# EAGLE design esquemático_CPLD (EAGLE 9.6.2)

## Sheet 1 of 4
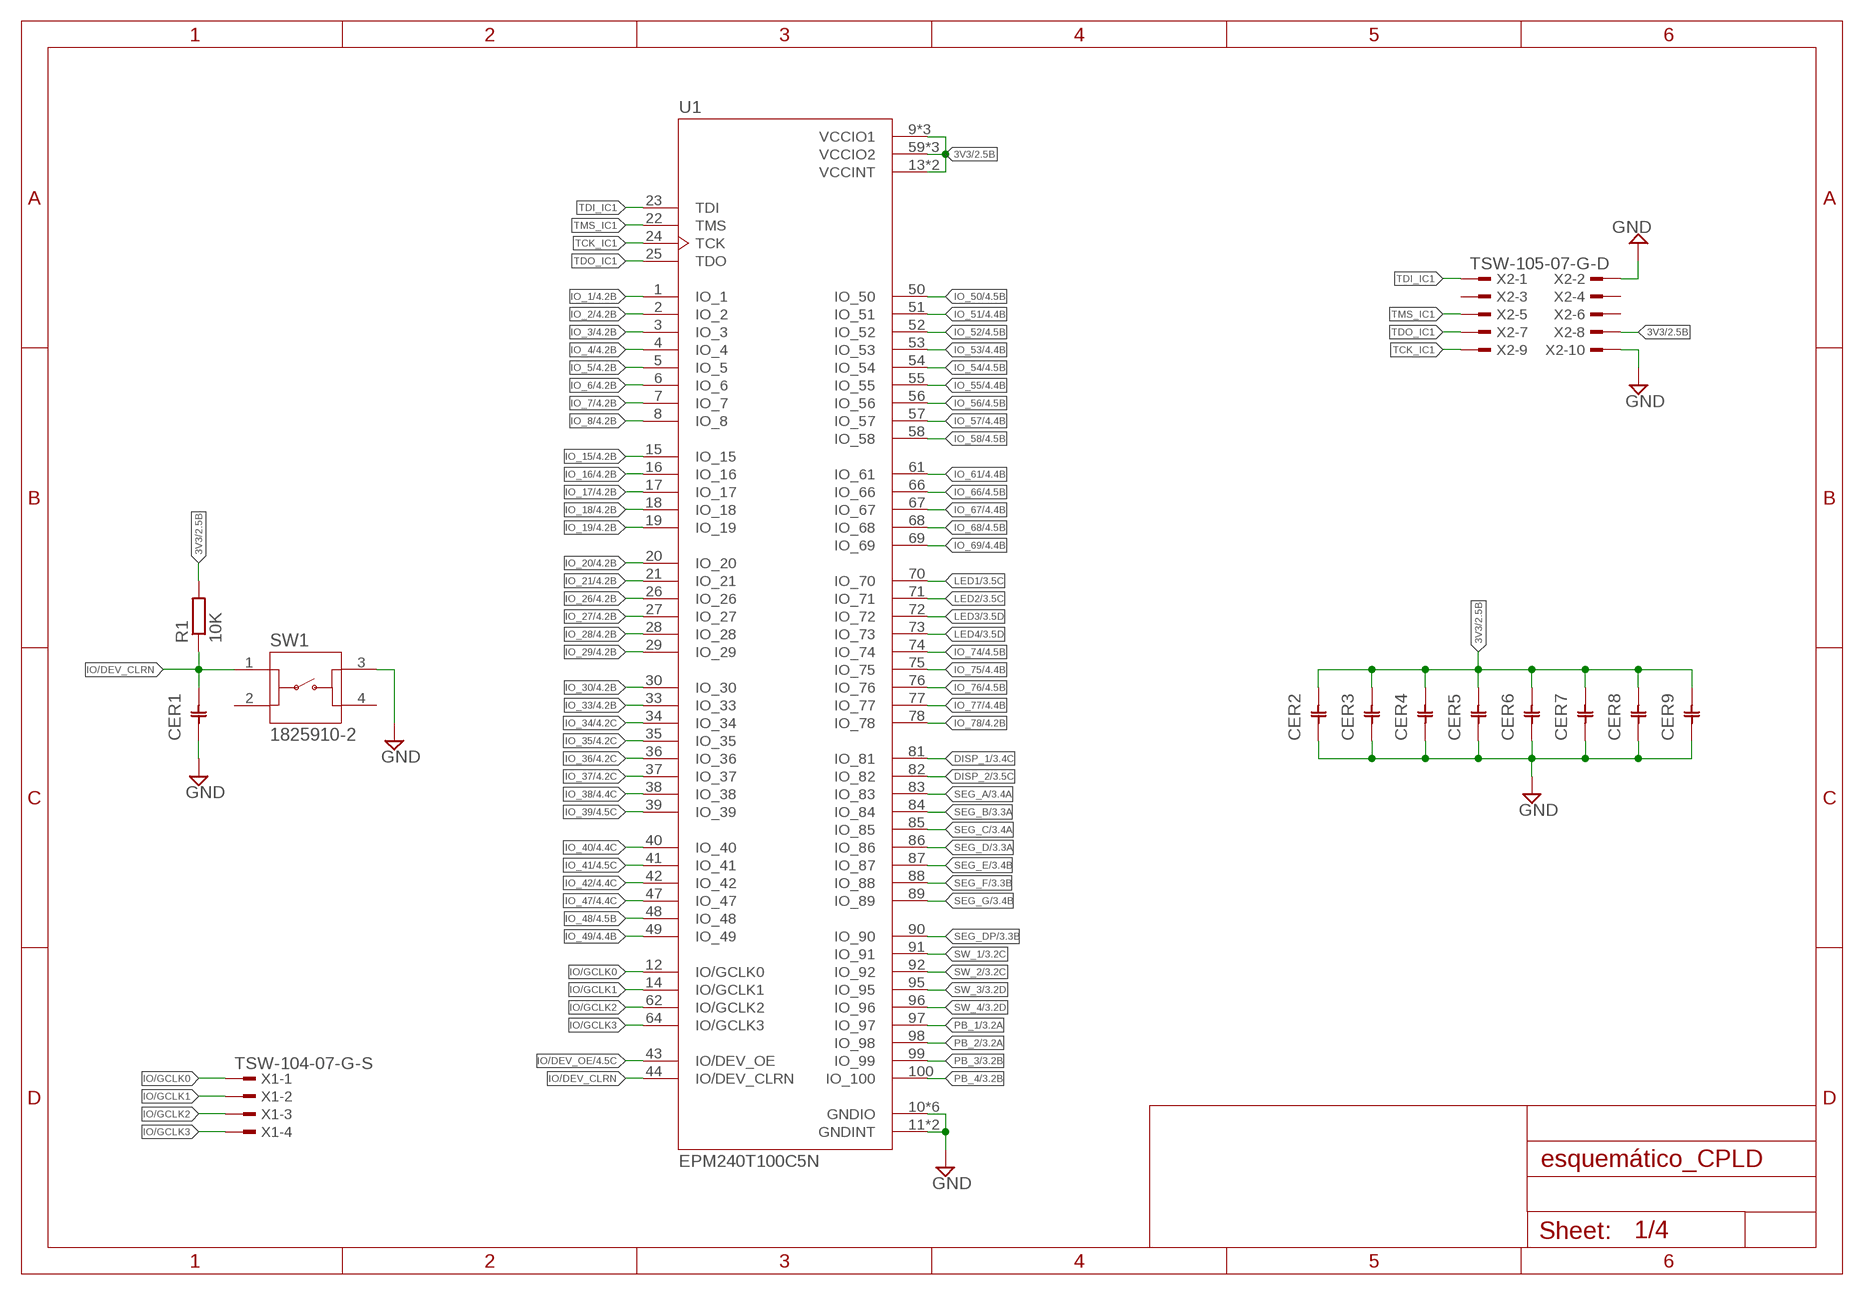
[diagram p0: schematic, sheet 1]

### Parts
CER1  100nF  -CERACAP  [CERACAPA]
CER2  100nF  -CERACAP  [CERACAPA]
CER3  100nF  -CERACAP  [CERACAPA]
CER4  100nF  -CERACAP  [CERACAPA]
CER5  100nF  -CERACAP  [CERACAPA]
CER6  100nF  -CERACAP  [CERACAPA]
CER7  100nF  -CERACAP  [CERACAPA]
CER8  100nF  -CERACAP  [CERACAPA]
CER9  100nF  -CERACAP  [CERACAPA]
R1  10K  R-EU_0204/7  [0204/7]
SW1  1825910-2  [TE_1825910-2]
U1  EPM240T100C5N  [QFP50P1600X1600X120-100N]
X1  TSW-104-07-G-S  [TSW-104-XX-G-S]
X2  TSW-105-07-G-D  [TSW-105-XX-G-D]

### Nets
3V3: CER2.P$2 CER3.P$2 CER4.P$2 CER5.P$2 CER6.P$2 CER7.P$2 CER8.P$2 CER9.P$2 R1.2 U1.9(VCCIO1) U1.13(VCCINT) U1.31(VCCIO1) U1.45(VCCIO1) U1.59(VCCIO2) U1.63(VCCINT) U1.80(VCCIO2) U1.94(VCCIO2) X2.8 ; also sheet 2,3,4
DISP_1: U1.81(IO_81) ; also sheet 3
DISP_2: U1.82(IO_82) ; also sheet 3
GND: CER1.P$1 CER2.P$1 CER3.P$1 CER4.P$1 CER5.P$1 CER6.P$1 CER7.P$1 CER8.P$1 CER9.P$1 SW1.3 U1.10(GNDIO) U1.11(GNDINT) U1.32(GNDIO) U1.46(GNDIO) U1.60(GNDIO) U1.65(GNDINT) U1.79(GNDIO) U1.93(GNDIO) X2.2 X2.10 ; also sheet 2,3,4
IO/DEV_CLRN: CER1.P$2 R1.1 SW1.1 U1.44(IO/DEV_CLRN)
IO/DEV_OE: U1.43(IO/DEV_OE) ; also sheet 4
IO/GCLK0: U1.12(IO/GCLK0) X1.1
IO/GCLK1: U1.14(IO/GCLK1) X1.2
IO/GCLK2: U1.62(IO/GCLK2) X1.3
IO/GCLK3: U1.64(IO/GCLK3) X1.4
IO_1: U1.1(IO_1) ; also sheet 4
IO_2: U1.2(IO_2) ; also sheet 4
IO_3: U1.3(IO_3) ; also sheet 4
IO_4: U1.4(IO_4) ; also sheet 4
IO_5: U1.5(IO_5) ; also sheet 4
IO_6: U1.6(IO_6) ; also sheet 4
IO_7: U1.7(IO_7) ; also sheet 4
IO_8: U1.8(IO_8) ; also sheet 4
IO_15: U1.15(IO_15) ; also sheet 4
IO_16: U1.16(IO_16) ; also sheet 4
IO_17: U1.17(IO_17) ; also sheet 4
IO_18: U1.18(IO_18) ; also sheet 4
IO_19: U1.19(IO_19) ; also sheet 4
IO_20: U1.20(IO_20) ; also sheet 4
IO_21: U1.21(IO_21) ; also sheet 4
IO_26: U1.26(IO_26) ; also sheet 4
IO_27: U1.27(IO_27) ; also sheet 4
IO_28: U1.28(IO_28) ; also sheet 4
IO_29: U1.29(IO_29) ; also sheet 4
IO_30: U1.30(IO_30) ; also sheet 4
IO_33: U1.33(IO_33) ; also sheet 4
IO_34: U1.34(IO_34) ; also sheet 4
IO_35: U1.35(IO_35) ; also sheet 4
IO_36: U1.36(IO_36) ; also sheet 4
IO_37: U1.37(IO_37) ; also sheet 4
IO_38: U1.38(IO_38) ; also sheet 4
IO_39: U1.39(IO_39) ; also sheet 4
IO_40: U1.40(IO_40) ; also sheet 4
IO_41: U1.41(IO_41) ; also sheet 4
IO_42: U1.42(IO_42) ; also sheet 4
IO_47: U1.47(IO_47) ; also sheet 4
IO_48: U1.48(IO_48) ; also sheet 4
IO_49: U1.49(IO_49) ; also sheet 4
IO_50: U1.50(IO_50) ; also sheet 4
IO_51: U1.51(IO_51) ; also sheet 4
IO_52: U1.52(IO_52) ; also sheet 4
IO_53: U1.53(IO_53) ; also sheet 4
IO_54: U1.54(IO_54) ; also sheet 4
IO_55: U1.55(IO_55) ; also sheet 4
IO_56: U1.56(IO_56) ; also sheet 4
IO_57: U1.57(IO_57) ; also sheet 4
IO_58: U1.58(IO_58) ; also sheet 4
IO_61: U1.61(IO_61) ; also sheet 4
IO_66: U1.66(IO_66) ; also sheet 4
IO_67: U1.67(IO_67) ; also sheet 4
IO_68: U1.68(IO_68) ; also sheet 4
IO_69: U1.69(IO_69) ; also sheet 4
IO_74: U1.74(IO_74) ; also sheet 4
IO_75: U1.75(IO_75) ; also sheet 4
IO_76: U1.76(IO_76) ; also sheet 4
IO_77: U1.77(IO_77) ; also sheet 4
IO_78: U1.78(IO_78) ; also sheet 4
LED1: U1.70(IO_70) ; also sheet 3
LED2: U1.71(IO_71) ; also sheet 3
LED3: U1.72(IO_72) ; also sheet 3
LED4: U1.73(IO_73) ; also sheet 3
PB_1: U1.97(IO_97) ; also sheet 3
PB_2: U1.98(IO_98) ; also sheet 3
PB_3: U1.99(IO_99) ; also sheet 3
PB_4: U1.100(IO_100) ; also sheet 3
SEG_A: U1.83(IO_83) ; also sheet 3
SEG_B: U1.84(IO_84) ; also sheet 3
SEG_C: U1.85(IO_85) ; also sheet 3
SEG_D: U1.86(IO_86) ; also sheet 3
SEG_DP: U1.90(IO_90) ; also sheet 3
SEG_E: U1.87(IO_87) ; also sheet 3
SEG_F: U1.88(IO_88) ; also sheet 3
SEG_G: U1.89(IO_89) ; also sheet 3
SW_1: U1.91(IO_91) ; also sheet 3
SW_2: U1.92(IO_92) ; also sheet 3
SW_3: U1.95(IO_95) ; also sheet 3
SW_4: U1.96(IO_96) ; also sheet 3
TCK_IC1: U1.24(TCK) X2.9
TDI_IC1: U1.23(TDI) X2.1
TDO_IC1: U1.25(TDO) X2.7
TMS_IC1: U1.22(TMS) X2.5
Unconnected: SW1.2 SW1.4 X2.3 X2.4 X2.6

## Sheet 2 of 4
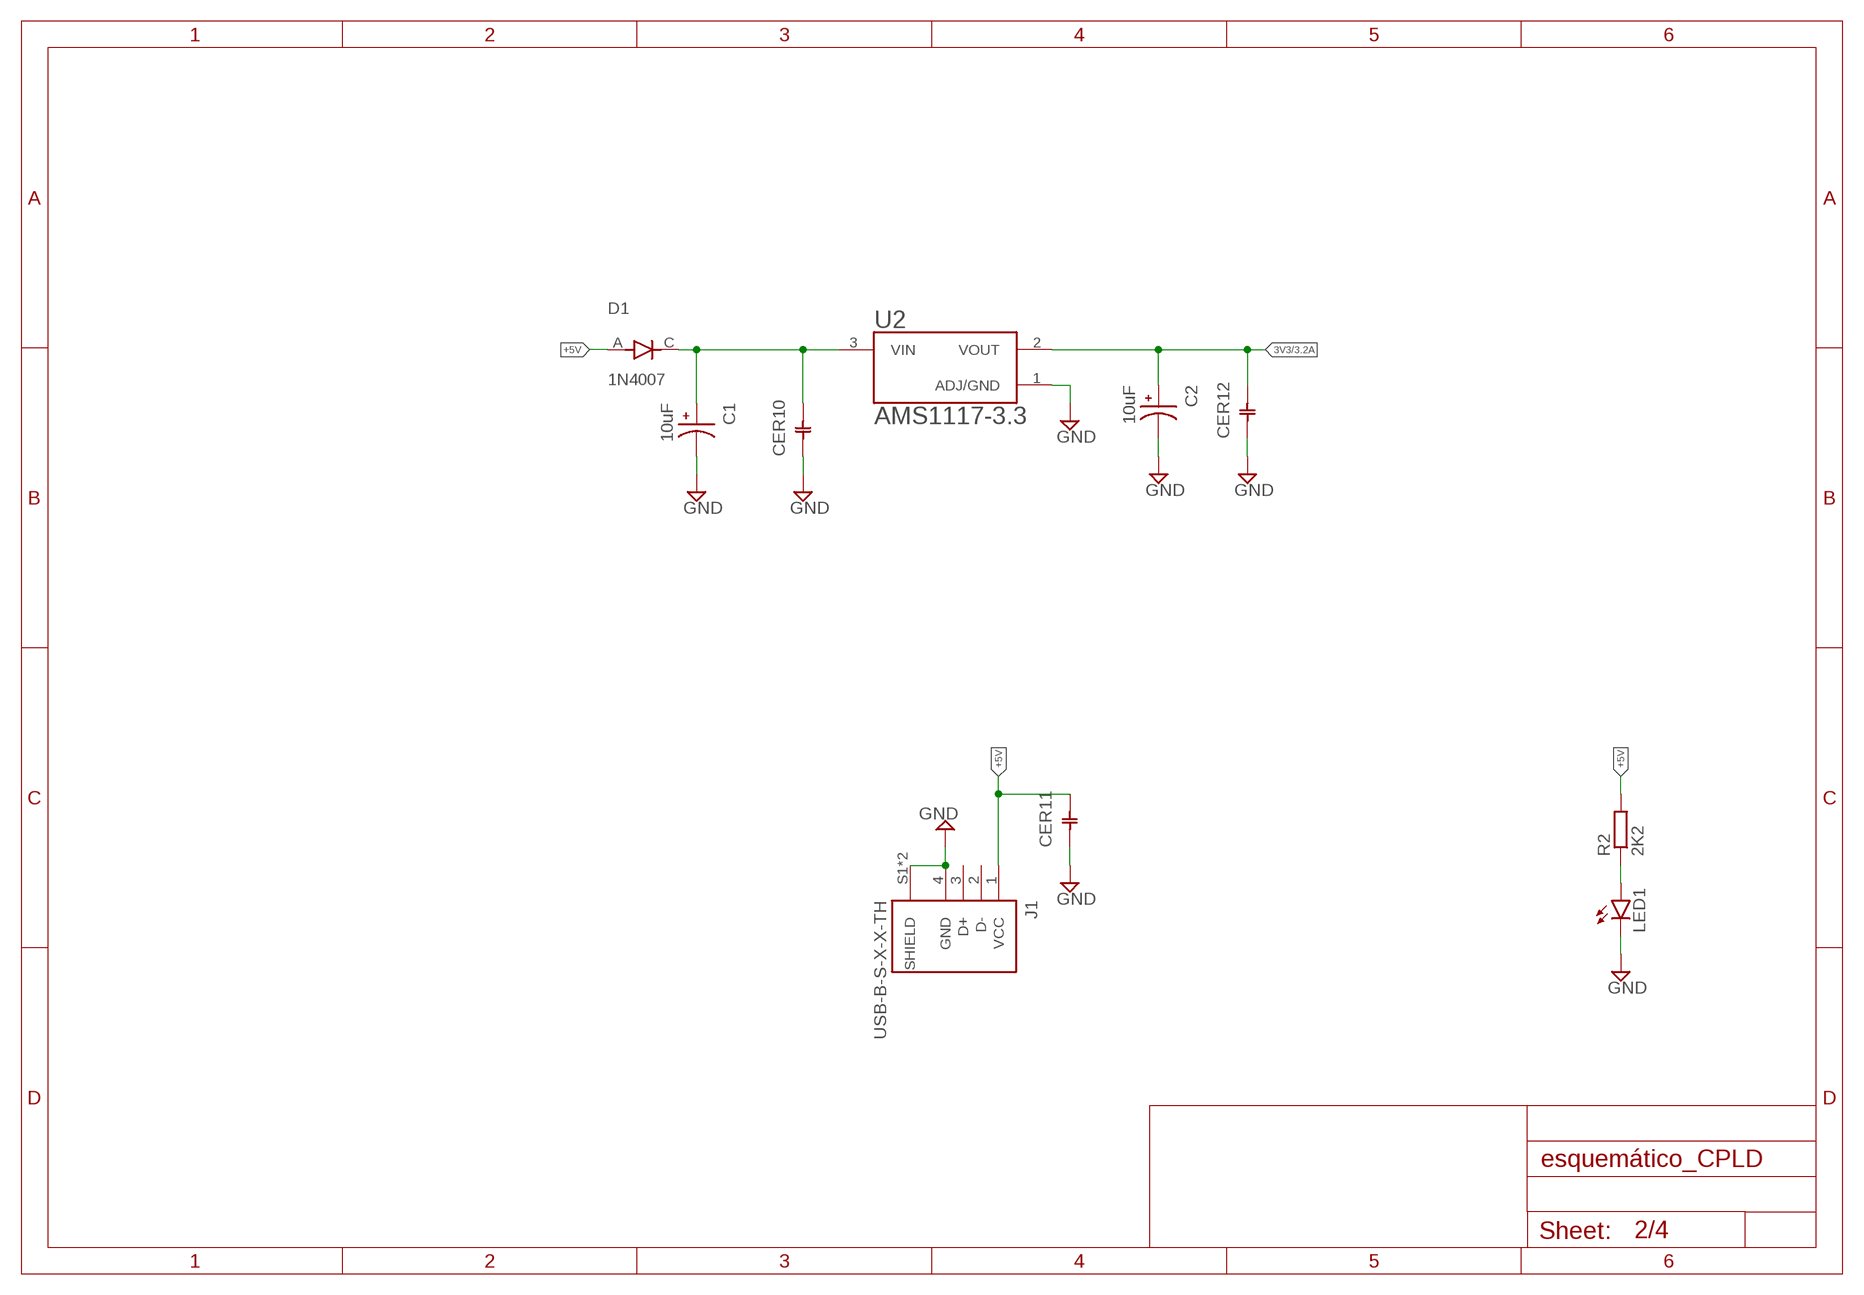
[diagram p1: schematic, sheet 2]

### Parts
C1  10uF  EEAGA1E100  [CAPPRD150W45D400H700]
C2  10uF  EEAGA1E100  [CAPPRD150W45D400H700]
CER10  100nF  -CERACAP  [CERACAPA]
CER11  100nF  -CERACAP  [CERACAPA]
CER12  100nF  -CERACAP  [CERACAPA]
D1  1N4007  [DIOAD1060W80L520D270]
J1  USB-B-S-X-X-TH  [SAMTEC_USB-B-S-X-X-TH]
LED1  LED5MM  [LED5MM]
R2  2K2  R-EU_0204/7  [0204/7]
U2  AMS1117-3.3  [SOT229P700X180-4N]

### Nets
3V3: C2.P CER12.P$2 U2.2(VOUT) ; also sheet 1,3,4
+5V: CER11.P$2 D1.A J1.1(VCC) R2.2
GND: C1.N C2.N CER10.P$1 CER11.P$1 CER12.P$1 J1.4(GND) J1.S1(SHIELD) J1.S2(SHIELD) LED1.K(C) U2.1(ADJ/GND) ; also sheet 1,3,4
N$13: LED1.A R2.1
N$14: C1.P CER10.P$2 D1.C U2.3(VIN)
Unconnected: J1.2(D-) J1.3(D+)

## Sheet 3 of 4
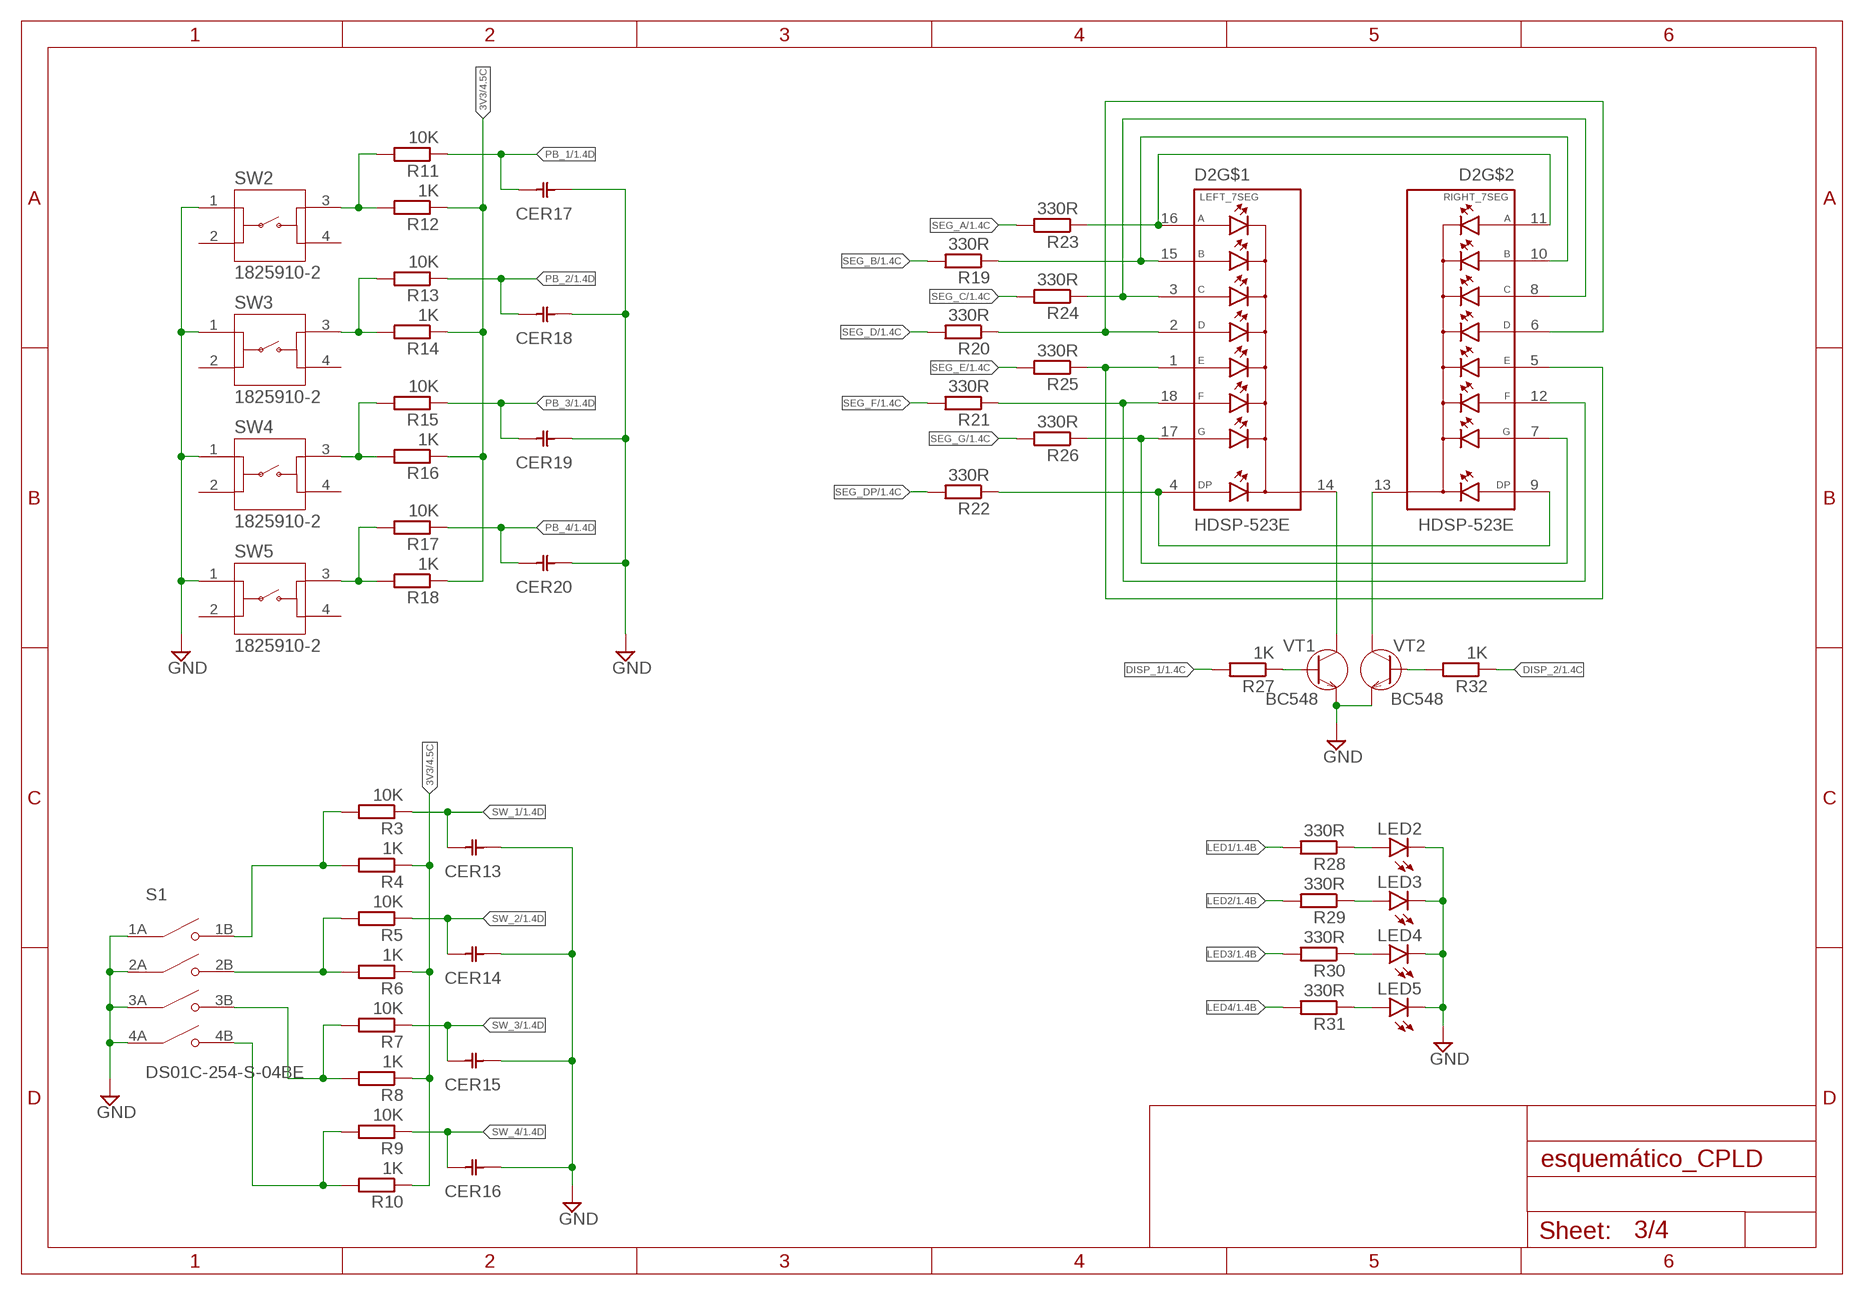
[diagram p2: schematic, sheet 3]

### Parts
CER13  100nF  -CERACAP  [CERACAPA]
CER14  100nF  -CERACAP  [CERACAPA]
CER15  100nF  -CERACAP  [CERACAPA]
CER16  100nF  -CERACAP  [CERACAPA]
CER17  100nF  -CERACAP  [CERACAPA]
CER18  100nF  -CERACAP  [CERACAPA]
CER19  100nF  -CERACAP  [CERACAPA]
CER20  100nF  -CERACAP  [CERACAPA]
D2  HDSP-523E  [LED_HDSP-523E]
LED2  LED5MM  [LED5MM]
LED3  LED5MM  [LED5MM]
LED4  LED5MM  [LED5MM]
LED5  LED5MM  [LED5MM]
R3  10K  R-EU_0204/7  [0204/7]
R4  1K  R-EU_0204/7  [0204/7]
R5  10K  R-EU_0204/7  [0204/7]
R6  1K  R-EU_0204/7  [0204/7]
R7  10K  R-EU_0204/7  [0204/7]
R8  1K  R-EU_0204/7  [0204/7]
R9  10K  R-EU_0204/7  [0204/7]
R10  1K  R-EU_0204/7  [0204/7]
R11  10K  R-EU_0204/7  [0204/7]
R12  1K  R-EU_0204/7  [0204/7]
R13  10K  R-EU_0204/7  [0204/7]
R14  1K  R-EU_0204/7  [0204/7]
R15  10K  R-EU_0204/7  [0204/7]
R16  1K  R-EU_0204/7  [0204/7]
R17  10K  R-EU_0204/7  [0204/7]
R18  1K  R-EU_0204/7  [0204/7]
R19  330R  R-EU_0204/7  [0204/7]
R20  330R  R-EU_0204/7  [0204/7]
R21  330R  R-EU_0204/7  [0204/7]
R22  330R  R-EU_0204/7  [0204/7]
R23  330R  R-EU_0204/7  [0204/7]
R24  330R  R-EU_0204/7  [0204/7]
R25  330R  R-EU_0204/7  [0204/7]
R26  330R  R-EU_0204/7  [0204/7]
R27  1K  R-EU_0204/7  [0204/7]
R28  330R  R-EU_0204/7  [0204/7]
R29  330R  R-EU_0204/7  [0204/7]
R30  330R  R-EU_0204/7  [0204/7]
R31  330R  R-EU_0204/7  [0204/7]
R32  1K  R-EU_0204/7  [0204/7]
S1  DS01C-254-S-04BE  [SW_DS01C-254-S-04BE]
SW2  1825910-2  [TE_1825910-2]
SW3  1825910-2  [TE_1825910-2]
SW4  1825910-2  [TE_1825910-2]
SW5  1825910-2  [TE_1825910-2]
VT1  BC548  [TO92]
VT2  BC548  [TO92]

### Nets
3V3: R4.1 R6.1 R8.1 R10.1 R12.1 R14.1 R16.1 R18.1 ; also sheet 1,2,4
DISP_1: R27.2 ; also sheet 1
DISP_2: R32.1 ; also sheet 1
GND: CER13.P$1 CER14.P$1 CER15.P$1 CER16.P$1 CER17.P$1 CER18.P$1 CER19.P$1 CER20.P$1 LED2.K(C) LED3.K(C) LED4.K(C) LED5.K(C) S1.1A(COM1) S1.2A(COM2) S1.3A(COM3) S1.4A(COM4) SW2.1 SW3.1 SW4.1 SW5.1 VT1.E VT2.E ; also sheet 1,2,4
LED1: R28.2 ; also sheet 1
LED2: R29.2 ; also sheet 1
LED3: R30.2 ; also sheet 1
LED4: R31.2 ; also sheet 1
N$29: R11.2 R12.2 SW2.3
N$30: R3.2 R4.2 S1.1B(NO1)
N$31: R5.2 R6.2 S1.2B(NO2)
N$32: R9.2 R10.2 S1.4B(NO4)
N$33: R7.2 R8.2 S1.3B(NO3)
N$34: R13.2 R14.2 SW3.3
N$35: R15.2 R16.2 SW4.3
N$36: R17.2 R18.2 SW5.3
N$37: D2.11(A_2) D2.16(A_1) R23.1
N$38: D2.10(B_2) D2.15(B_1) R19.1
N$39: D2.3(C_1) D2.8(C_2) R24.1
N$40: D2.2(D_1) D2.6(D_2) R20.1
N$41: D2.4(DP_1) D2.9(DP_2) R22.1
N$42: D2.7(G_2) D2.17(G_1) R26.1
N$43: D2.12(F_2) D2.18(F_1) R21.1
N$44: D2.1(E_1) D2.5(E_2) R25.1
N$45: D2.13(COM_2) VT2.C
N$46: D2.14(COM_1) VT1.C
N$47: R27.1 VT1.B
N$48: R32.2 VT2.B
N$49: LED2.A R28.1
N$50: LED3.A R29.1
N$51: LED4.A R30.1
N$52: LED5.A R31.1
PB_1: CER17.P$2 R11.1 ; also sheet 1
PB_2: CER18.P$2 R13.1 ; also sheet 1
PB_3: CER19.P$2 R15.1 ; also sheet 1
PB_4: CER20.P$2 R17.1 ; also sheet 1
SEG_A: R23.2 ; also sheet 1
SEG_B: R19.2 ; also sheet 1
SEG_C: R24.2 ; also sheet 1
SEG_D: R20.2 ; also sheet 1
SEG_DP: R22.2 ; also sheet 1
SEG_E: R25.2 ; also sheet 1
SEG_F: R21.2 ; also sheet 1
SEG_G: R26.2 ; also sheet 1
SW_1: CER13.P$2 R3.1 ; also sheet 1
SW_2: CER14.P$2 R5.1 ; also sheet 1
SW_3: CER15.P$2 R7.1 ; also sheet 1
SW_4: CER16.P$2 R9.1 ; also sheet 1
Unconnected: SW2.2 SW2.4 SW3.2 SW3.4 SW4.2 SW4.4 SW5.2 SW5.4

## Sheet 4 of 4
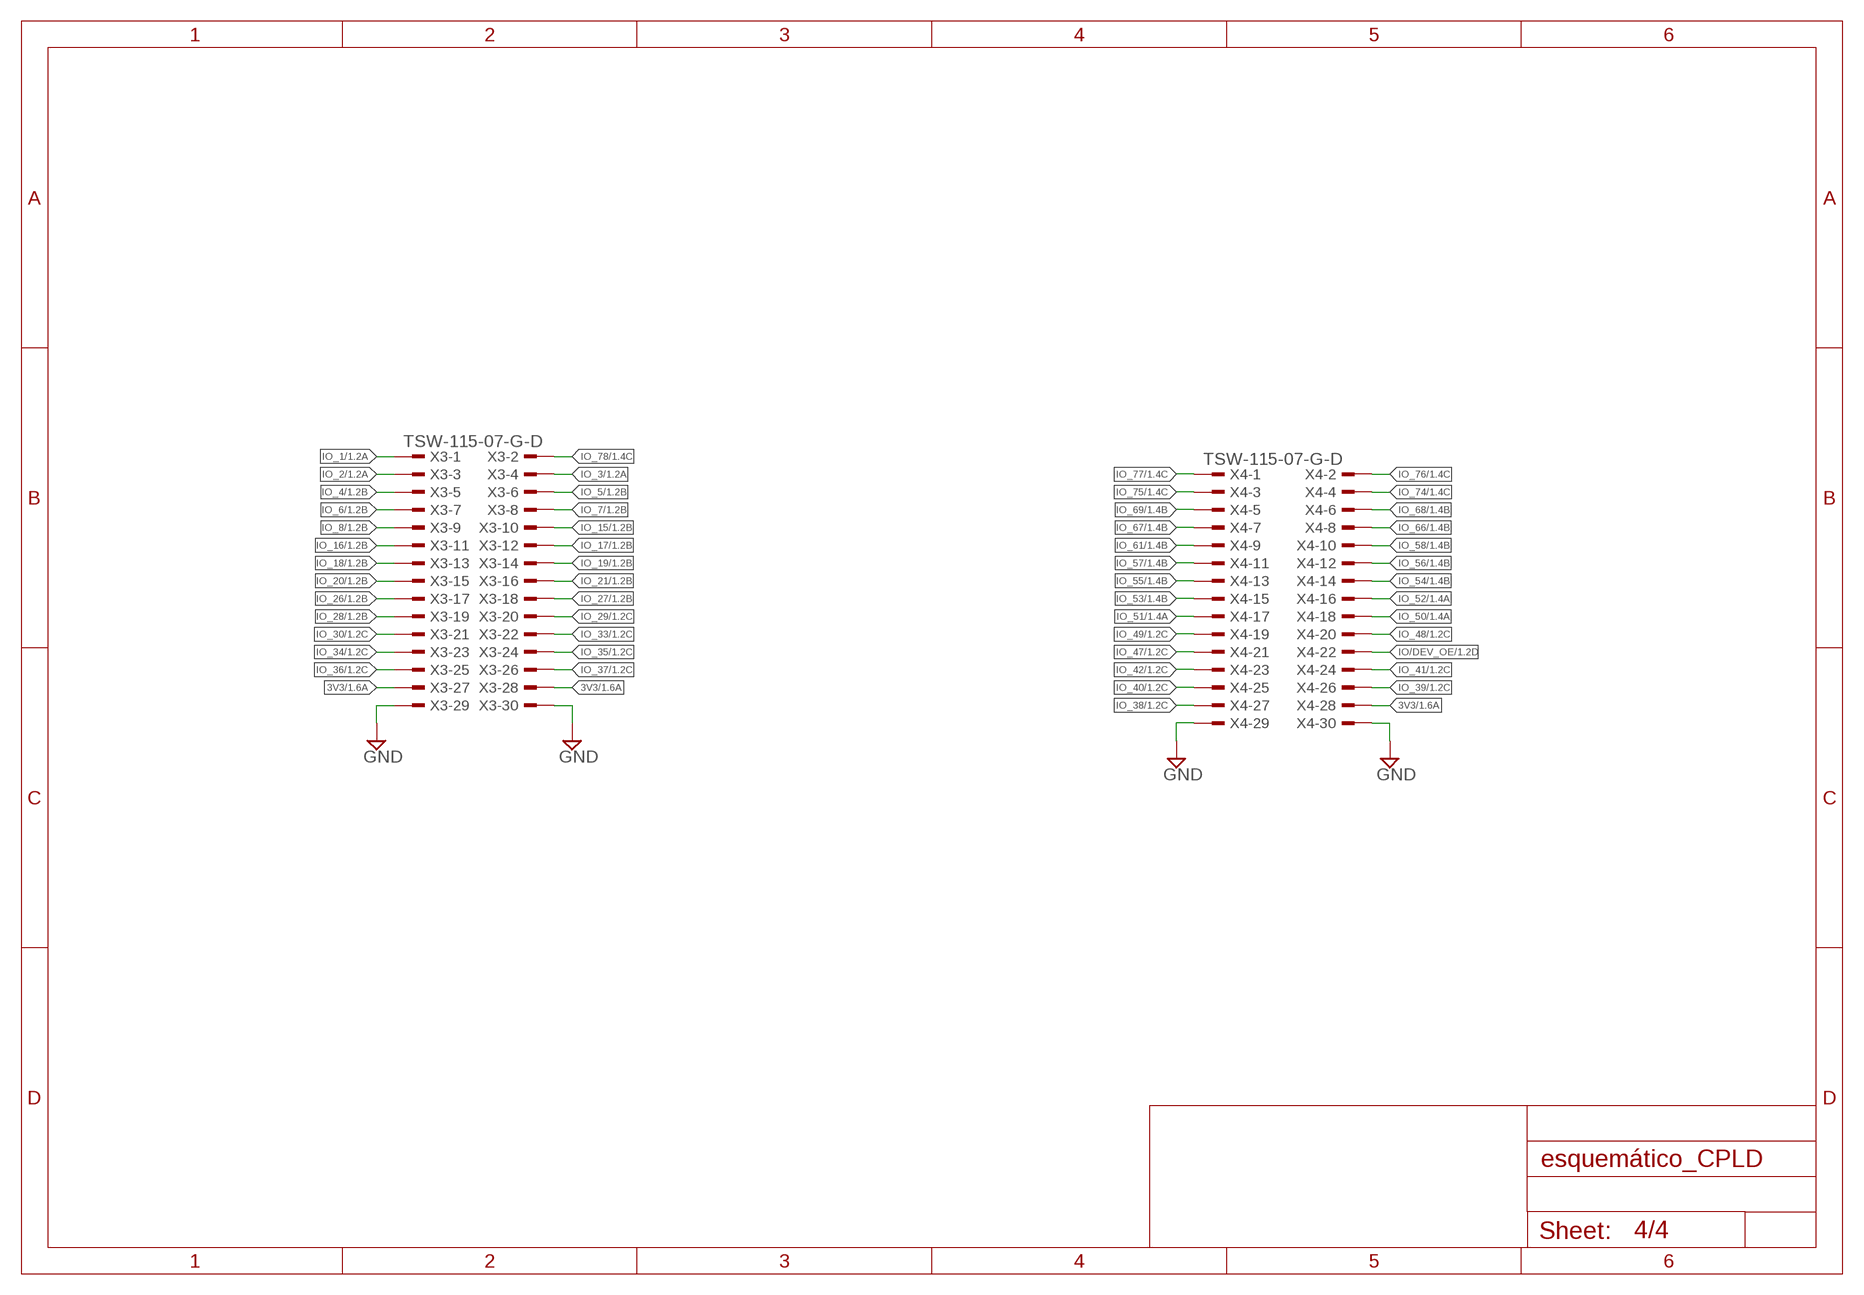
[diagram p3: schematic, sheet 4]

### Parts
X3  TSW-115-07-G-D  [TSW-115-XX-G-D]
X4  TSW-115-07-G-D  [TSW-115-XX-G-D]

### Nets
3V3: X3.27 X3.28 X4.28 ; also sheet 1,2,3
GND: X3.29 X3.30 X4.29 X4.30 ; also sheet 1,2,3
IO/DEV_OE: X4.22 ; also sheet 1
IO_1: X3.1 ; also sheet 1
IO_2: X3.3 ; also sheet 1
IO_3: X3.4 ; also sheet 1
IO_4: X3.5 ; also sheet 1
IO_5: X3.6 ; also sheet 1
IO_6: X3.7 ; also sheet 1
IO_7: X3.8 ; also sheet 1
IO_8: X3.9 ; also sheet 1
IO_15: X3.10 ; also sheet 1
IO_16: X3.11 ; also sheet 1
IO_17: X3.12 ; also sheet 1
IO_18: X3.13 ; also sheet 1
IO_19: X3.14 ; also sheet 1
IO_20: X3.15 ; also sheet 1
IO_21: X3.16 ; also sheet 1
IO_26: X3.17 ; also sheet 1
IO_27: X3.18 ; also sheet 1
IO_28: X3.19 ; also sheet 1
IO_29: X3.20 ; also sheet 1
IO_30: X3.21 ; also sheet 1
IO_33: X3.22 ; also sheet 1
IO_34: X3.23 ; also sheet 1
IO_35: X3.24 ; also sheet 1
IO_36: X3.25 ; also sheet 1
IO_37: X3.26 ; also sheet 1
IO_38: X4.27 ; also sheet 1
IO_39: X4.26 ; also sheet 1
IO_40: X4.25 ; also sheet 1
IO_41: X4.24 ; also sheet 1
IO_42: X4.23 ; also sheet 1
IO_47: X4.21 ; also sheet 1
IO_48: X4.20 ; also sheet 1
IO_49: X4.19 ; also sheet 1
IO_50: X4.18 ; also sheet 1
IO_51: X4.17 ; also sheet 1
IO_52: X4.16 ; also sheet 1
IO_53: X4.15 ; also sheet 1
IO_54: X4.14 ; also sheet 1
IO_55: X4.13 ; also sheet 1
IO_56: X4.12 ; also sheet 1
IO_57: X4.11 ; also sheet 1
IO_58: X4.10 ; also sheet 1
IO_61: X4.9 ; also sheet 1
IO_66: X4.8 ; also sheet 1
IO_67: X4.7 ; also sheet 1
IO_68: X4.6 ; also sheet 1
IO_69: X4.5 ; also sheet 1
IO_74: X4.4 ; also sheet 1
IO_75: X4.3 ; also sheet 1
IO_76: X4.2 ; also sheet 1
IO_77: X4.1 ; also sheet 1
IO_78: X3.2 ; also sheet 1

## Library data of the parts
C1 C2 = CAPEL10uF:EEAGA1E100: GA-A Check prices <https://pricing.snapeda.com/parts/EEAGA1E100/Panasonic/view-part?ref=eda>; AVAILABILITY: In Stock; DESCRIPTION: CAP ALUM 10UF 20% 25V RADIAL; MF: Panasonic; MP: EEAGA1E100; PACKAGE: RADIAL-2 Panasonic; PRICE: None
CER1-CER20 = res:-CERACAP
D1 = 1N4007:1N4007: Diode Switching 1KV 1A 2-Pin DO-41 Check prices <https://pricing.snapeda.com/parts/1N4007./Multicomp/view-part?ref=eda>; AVAILABILITY: In Stock; DESCRIPTION: Diode, Standard, 1a, 1000v; MF: Multicomp; MP: 1N4007.; PACKAGE: DO-41 Multicomp; PRICE: None
D2 = HDSP-523E:HDSP-523E: Display Modules - LED Character and Numeric Red 7-Segment 2 Character Common Cathode 2.05V 20mA 0.732in H x 0.984in W x 0.315in D (18.60mm x 25.00mm x 8.00mm) 18-DIP (0.600in, 15.24mm) Check prices <https://pricing.snapeda.com/parts/HDSP-523E/Broadcom/view-part?ref=eda>; AVAILABILITY: In Stock; DESCRIPTION: Display Modules - LED Character and Numeric Red 7-Segment 2 Character Common Cathode 2.05V 20mA 0.732 H x 0.984 W x 0.315 D (18.60mm x 25.00mm x 8.00mm) 18-DIP (0.600, 15.24mm); MF: Broadcom; MP: HDSP-523E; PACKAGE: DIP-18 Avago; PRICE: None; PURCHASE-URL: https://pricing.snapeda.com/search/part/HDSP-523E/?ref=eda
J1 = USB-B-S-X-X-TH:USB-B-S-X-X-TH: USB-B (USB TYPE-B) USB 2.0 Receptacle Connector 4 Position Through Hole, Right Angle Check prices <https://pricing.snapeda.com/parts/USB-B-S-F-B-TH-TR/Samtec/view-part?ref=eda>; AVAILABILITY: In Stock; DESCRIPTION: USB-B (USB TYPE-B) USB 2.0 Receptacle Connector 4 Position Through Hole, Right Angle; MF: Samtec; MP: USB-B-S-F-B-TH-TR; PACKAGE: None; PRICE: None; PURCHASE-URL: https://pricing.snapeda.com/search/part/USB-B-S-F-B-TH-TR/?ref=eda
LED1-LED5 = led:LED: LED OSRAM: - CHIPLED LG R971, LG N971, LY N971, LG Q971, LY Q971, LO R971, LY R971 LH N974, LH R974 LS Q976, LO Q976, LY Q976 LO Q996 - Hyper CHIPLED LW Q18S LB Q993, LB Q99A, LB R99A - SideLED LS A670, LO A670, LY A670, LG A670, LP A670 LB A673, LV A673, LT A673, LW A673 LH A674 LY A675 LS A676, LA A676, LO A676, LY A676, LW A676 LS A679, LY A679, LG A679 - Hyper Micro SIDELED® LS Y876, LA Y876, LO Y876, LY Y876 LT Y87S - SmartLED LW L88C, LW L88S LB L89C, LB L89S, LG L890 LS L89K, LO L89K, LY L89K LS L896, LA L896, LO L896, LY L896 - TOPLED LS T670, LO T670, LY T670, LG T670, LP T670 LSG T670, LSP T670, LSY T670, LOP T670, LYG T670 LG T671, LOG T671, LSG T671 LB T673, LV T673, LT T673, LW T673 LH T674 LS T676, LA T676, LO T676, LY T676, LB T676, LH T676, LSB T676, LW T676 LB T67C, LV T67C, LT T67C, LS T67K, LO T67K, LY T67K, LW E67C LS E67B, LA E67B, LO E67B, LY E67B, LB E67C, LV E67C, LT E67C LW T67C LS T679, LY T679, LG T679 LS T770, LO T770, LY T770, LG T770, LP T770 LB T773, LV T773, LT T773, LW T773 LH T774 LS E675, LA E675, LY E675, LS T675 LS T776, LA T776, LO T776, LY T776, LB T776 LHGB T686 LT T68C, LB T68C - Hyper Mini TOPLED® LB M676 - Mini TOPLED Santana® LG M470 LS M47K, LO M47K, LY M47K Source: http://www.osram.convergy.de LUXEON: - LUMILED® LXK2-PW12-R00, LXK2-PW12-S00, LXK2-PW14-U00, LXK2-PW14-V00 LXK2-PM12-R00, LXK2-PM12-S00, LXK2-PM14-U00 LXK2-PE12-Q00, LXK2-PE12-R00, LXK2-PE12-S00, LXK2-PE14-T00, LXK2-PE14-U00 LXK2-PB12-K00, LXK2-PB12-L00, LXK2-PB12-M00, LXK2-PB14-N00, LXK2-PB14-P00, LXK2-PB14-Q00 LXK2-PR12-L00, LXK2-PR12-M00, LXK2-PR14-Q00, LXK2-PR14-R00 LXK2-PD12-Q00, LXK2-PD12-R00, LXK2-PD12-S00 LXK2-PH12-R00, LXK2-PH12-S00 LXK2-PL12-P00, LXK2-PL12-Q00, LXK2-PL12-R00 Source: www.luxeon.com KINGBRIGHT: KA-3528ASYC Source: www.kingbright.com
R1-R32 = rcl:R-EU_: RESISTOR, European symbol; SPICEPREFIX: R
S1 = DS01C-254-S-04BE:DS01C-254-S-04BE: Check prices <https://pricing.snapeda.com/parts/DS01C-254-S-04BE/CUI%20Devices/view-part?ref=eda>; AVAILABILITY: In Stock; CUI_PURCHASE_URL: https://www.cuidevices.com/product/switches/dip-switches/ds01-254-series?utm_source=snapeda.com&utm_medium=referral&utm_campaign=snapedaBOM; DESCRIPTION: 4 Position, Through Hole, 2.54 mm Pitch, Raised Slide Actuator, Convex Bottom, Short Pin, DIP Switch; MF: CUI Devices; MP: DS01C-254-S-04BE; PACKAGE: None; PRICE: None; PURCHASE-URL: https://pricing.snapeda.com/search/part/DS01C-254-S-04BE/?ref=eda
SW1-SW5 = pushbutton:1825910-2: SWITCH TACTILE SPST-NO 0.05A 24V Check prices <https://pricing.snapeda.com/parts/1825910-2/TE%20Connectivity/view-part?ref=eda>; AVAILABILITY: In Stock; COMMENT: 1825910-2; CONFIGURATION_POLE-THROW: Single Pole - Single Throw; CONTACT_CURRENT_RATING: 50 mA; DESCRIPTION: 50 mA SPST Round Actuator 160 Gram Force Tactile Pushbutton Switch; EU_ROHS_COMPLIANCE: Compliant; MF: TE Connectivity; MP: 1825910-2; PACKAGE: None; PRICE: None; PURCHASE-URL: https://pricing.snapeda.com/search/part/1825910-2/?ref=eda
U1 = EPM240T100C5N:EPM240T100C5N: CPLD MAX II Family 192 Macro Cells 201.1MHz 0.18um Technology 2.5V/3.3V 100-Pin TQFP Check availability <https://pricing.snapeda.com/parts/EPM240T100C5N/Intel/view-part?ref=eda>; AVAILABILITY: In Stock; DESCRIPTION: IC CPLD 192MC 4.7NS 100TQFP; MF: Intel; MP: EPM240T100C5N; PACKAGE: QFN-100 Intel; PRICE: None; PURCHASE-URL: https://pricing.snapeda.com/search/part/EPM240T100C5N/?ref=eda
U2 = AMS1117-3.3:AMS1117-3.3: Sot223/Pkg 1-Amp 3.3-Volt Low Drop Out Voltage Regulatator Check availability <https://pricing.snapeda.com/parts/AMS1117-3.3/Advanced%20Monolithic%20Systems/view-part?ref=eda>; AVAILABILITY: In Stock; DESCRIPTION: Sot223/Pkg 1-Amp 3.3-Volt Low Drop Out Voltage Regulatator; MF: Advanced Monolithic Systems; MP: AMS1117-3.3; PACKAGE: SOT-223 Seeed Technology; PRICE: None
VT1 VT2 = BC548:BC548: BC548 Check prices <https://pricing.snapeda.com/parts/BC548/ON/view-part?ref=eda>; AVAILABILITY: In Stock; DESCRIPTION: Bipolar (BJT) Transistor NPN 30 V 100 mA 300MHz 625 mW Through Hole TO-92 (TO-226); MF: ON; MP: BC548; PACKAGE: E-PKG AXIAL-LEADED-2 ON Semiconductor; PRICE: None; PURCHASE-URL: https://pricing.snapeda.com/search/part/BC548/?ref=eda
X1 = con-samtec:TSW-104-*-G-S: THROUGH-HOLE .025" SQ POST HEADER Source: Samtec TSW.pdf; MF: Samtec Inc.; MPN: TSW-104-07-G-S
X2 = con-samtec:TSW-105-*-G: THROUGH-HOLE .025" SQ POST HEADER Source: Samtec TSW.pdf; MF: Samtec Inc.; MPN: TSW-105-07-G-D
X3 X4 = con-samtec:TSW-115-*-G: THROUGH-HOLE .025" SQ POST HEADER Source: Samtec TSW.pdf; MF: Samtec Inc.; MPN: TSW-115-07-G-D

## Board
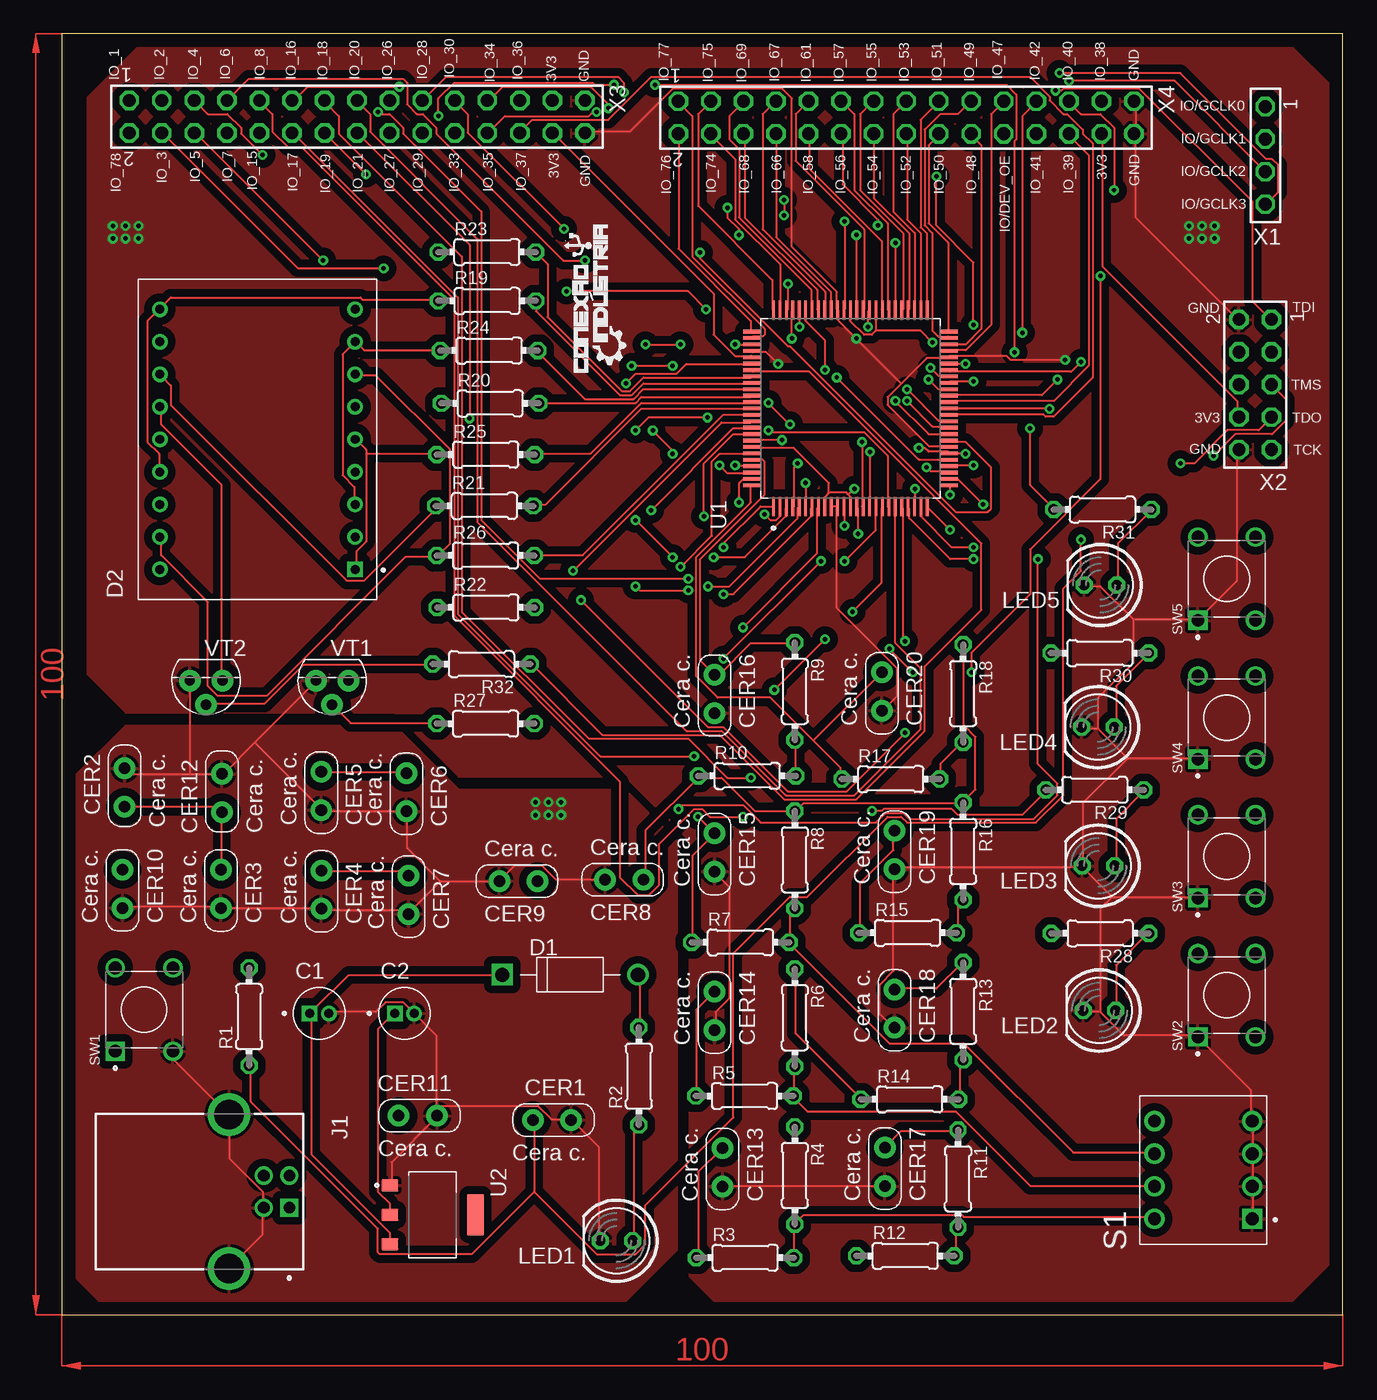
[diagram p4: board, top side]
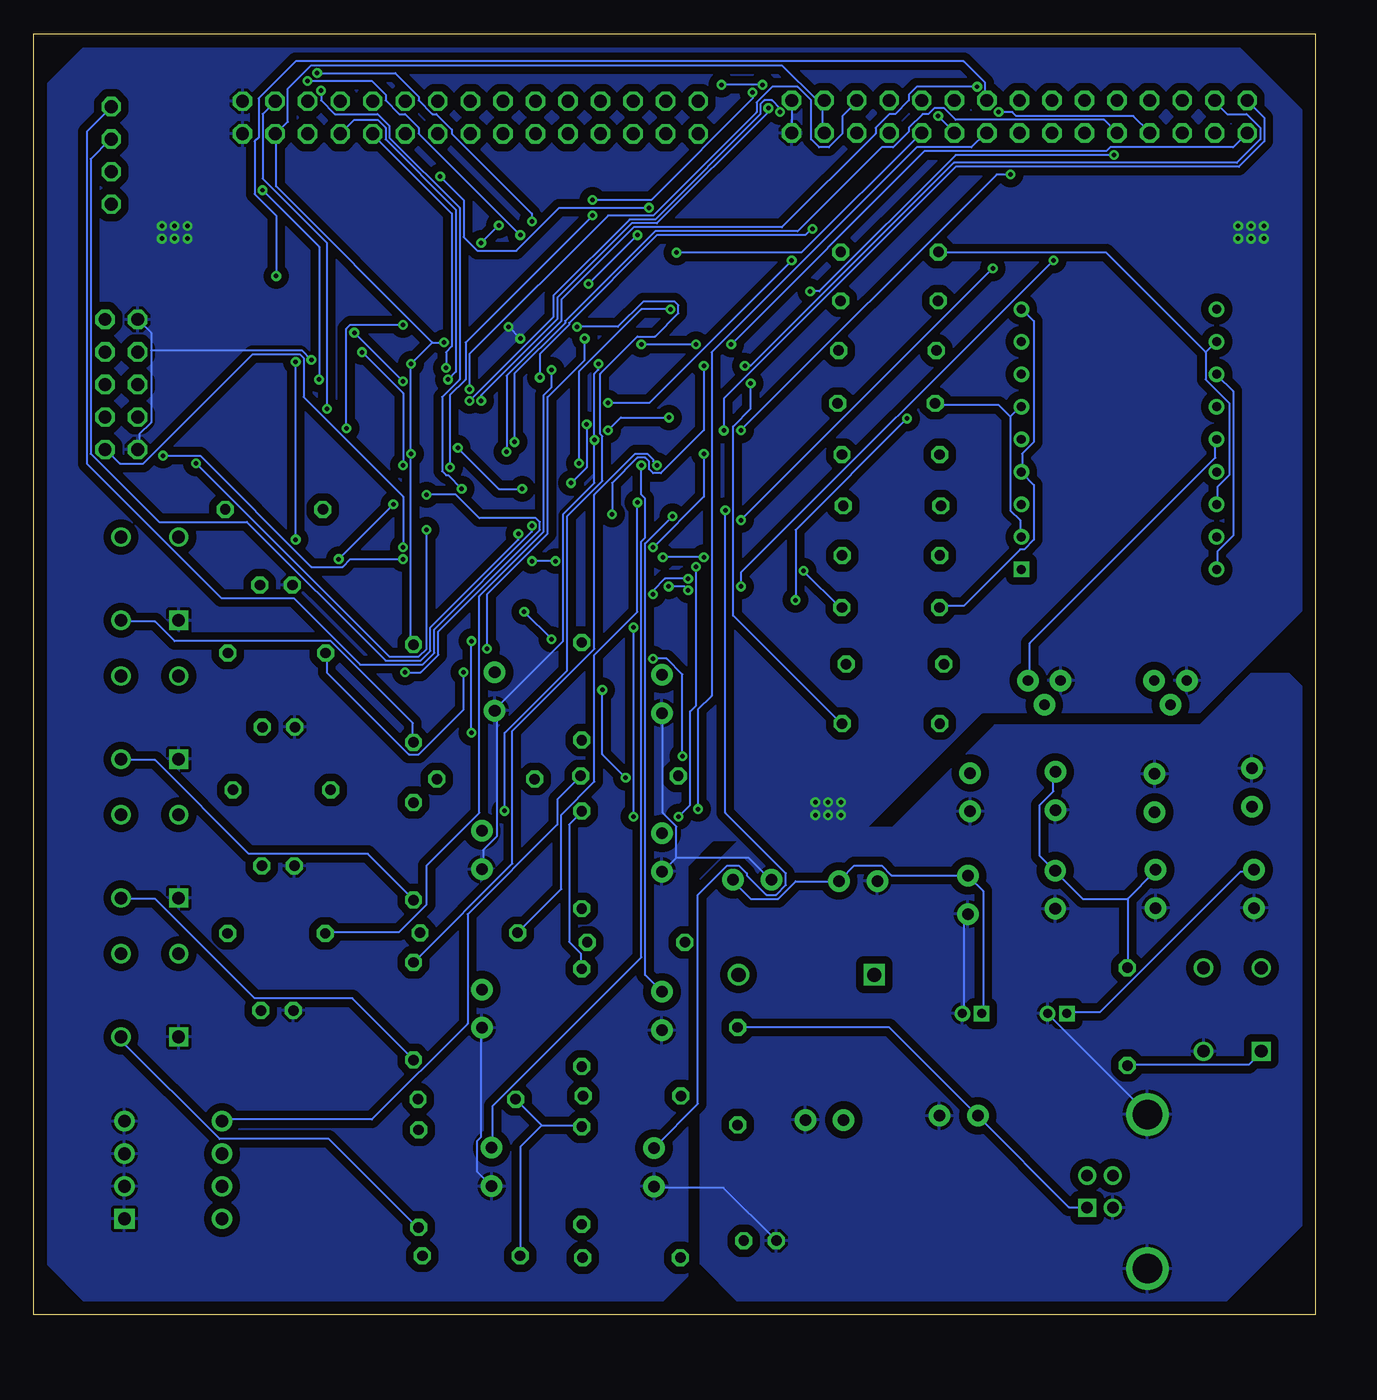
[diagram p5: board, bottom side, seen from below]

Size 100 x 100 mm. Coordinates in mm from the lower left corner, seen from the top.
Outline: 0,100 0,0 100,0 100,100 0,100
Copper layers (1*16): Top 0.035mm / dielectric 1.5mm / Bottom 0.035mm
Design rules "default *": minimum track width 6mil, minimum drill 0.35mm, track to track 6mil, track to pad 6mil, pad to pad 6mil, via to via 6mil, smd to smd 6mil, copper to edge 40mil, drill to drill 6mil, minimum pad ring 10mil, minimum via ring 8mil, stop-mask expansion 4mil, vias tented up to drill 0mil, thermal gap 10mil

### Footprints (pad centres in the part's own frame; a part is rotated, then mirrored left to right if it is on the bottom)
CAPPRD150W45D400H700 = drill 0.7 pad 1.05: N 0.75,0 | drill 0.7 pad 1.05 square: P -0.75,0
CERACAPA = drill 0.9 pad 1.676: P$1 -1.372,0; P$2 1.626,0
DIOAD1060W80L520D270 = drill 1.1 pad 1.65: A 5.3,0 | drill 1.1 pad 1.65 square: C -5.3,0
LED_HDSP-523E = drill 0.7 square: 1 -10.16,-7.62 | drill 0.7: 2 -7.62,-7.62; 3 -5.08,-7.62; 4 -2.54,-7.62; 5 0,-7.62; 6 2.54,-7.62; 7 5.08,-7.62; 8 7.62,-7.62; 9 10.16,-7.62; 10 10.16,7.62; 11 7.62,7.62; 12 5.08,7.62; 13 2.54,7.62; 14 0,7.62; 15 -2.54,7.62; 16 -5.08,7.62; 17 -7.62,7.62; 18 -10.16,7.62
SAMTEC_USB-B-S-X-X-TH = drill 0.9 square: 1 1.25,4.7 | drill 0.9: 2 -1.25,4.7; 3 -1.25,2.7; 4 1.25,2.7 | drill 2.3: S1 -6.02,0; S2 6.02,0
LED5MM = drill 0.813 octagon: A -1.27,0; K 1.27,0
0204/7 = drill 0.813 octagon: 1 -3.81,0; 2 3.81,0
SW_DS01C-254-S-04BE = drill 1 pad 1.58 square: 1A -3.81,-3.81 | drill 1 pad 1.58: 1B -3.81,3.81; 2A -1.27,-3.81; 2B -1.27,3.81; 3A 1.27,-3.81; 3B 1.27,3.81; 4A 3.81,-3.81; 4B 3.81,3.81
TE_1825910-2 = drill 0.99 square: 1 0,0 | drill 0.99: 2 6.5,0; 3 0,-4.5; 4 6.5,-4.5
QFP50P1600X1600X120-100N = smd 1.47 x 0.28: 1 -7.67,6; 2 -7.67,5.5; 3 -7.67,5; 4 -7.67,4.5; 5 -7.67,4; 6 -7.67,3.5; 7 -7.67,3; 8 -7.67,2.5; 9 -7.67,2; 10 -7.67,1.5; 11 -7.67,1; 12 -7.67,0.5; 13 -7.67,0; 14 -7.67,-0.5; 15 -7.67,-1; 16 -7.67,-1.5; 17 -7.67,-2; 18 -7.67,-2.5; 19 -7.67,-3; 20 -7.67,-3.5; 21 -7.67,-4; 22 -7.67,-4.5; 23 -7.67,-5; 24 -7.67,-5.5; 25 -7.67,-6; 51 7.67,-6; 52 7.67,-5.5; 53 7.67,-5; 54 7.67,-4.5; 55 7.67,-4; 56 7.67,-3.5; 57 7.67,-3; 58 7.67,-2.5; 59 7.67,-2; 60 7.67,-1.5; 61 7.67,-1; 62 7.67,-0.5; 63 7.67,0; 64 7.67,0.5; 65 7.67,1; 66 7.67,1.5; 67 7.67,2; 68 7.67,2.5; 69 7.67,3; 70 7.67,3.5; 71 7.67,4; 72 7.67,4.5; 73 7.67,5; 74 7.67,5.5; 75 7.67,6 | smd 0.28 x 1.47: 26 -6,-7.67; 27 -5.5,-7.67; 28 -5,-7.67; 29 -4.5,-7.67; 30 -4,-7.67; 31 -3.5,-7.67; 32 -3,-7.67; 33 -2.5,-7.67; 34 -2,-7.67; 35 -1.5,-7.67; 36 -1,-7.67; 37 -0.5,-7.67; 38 0,-7.67; 39 0.5,-7.67; 40 1,-7.67; 41 1.5,-7.67; 42 2,-7.67; 43 2.5,-7.67; 44 3,-7.67; 45 3.5,-7.67; 46 4,-7.67; 47 4.5,-7.67; 48 5,-7.67; 49 5.5,-7.67; 50 6,-7.67; 76 6,7.67; 77 5.5,7.67; 78 5,7.67; 79 4.5,7.67; 80 4,7.67; 81 3.5,7.67; 82 3,7.67; 83 2.5,7.67; 84 2,7.67; 85 1.5,7.67; 86 1,7.67; 87 0.5,7.67; 88 0,7.67; 89 -0.5,7.67; 90 -1,7.67; 91 -1.5,7.67; 92 -2,7.67; 93 -2.5,7.67; 94 -3,7.67; 95 -3.5,7.67; 96 -4,7.67; 97 -4.5,7.67; 98 -5,7.67; 99 -5.5,7.67; 100 -6,7.67
SOT229P700X180-4N = smd 0.93 x 1.31: 1 -2.29,-3.345; 2 0,-3.345; 3 2.29,-3.345 | smd 3.24 x 1.31: 4 0,3.345
TO92 = drill 0.813 pad 1.676: B 0,1.905; C -1.27,0; E 1.27,0
TSW-104-XX-G-S = drill 1 pad 1.5 octagon: 1 3.81,0; 2 1.27,0; 3 -1.27,0; 4 -3.81,0
TSW-105-XX-G-D = drill 1 pad 1.5 octagon: 1 5.08,-1.27; 2 5.08,1.27; 3 2.54,-1.27; 4 2.54,1.27; 5 0,-1.27; 6 0,1.27; 7 -2.54,-1.27; 8 -2.54,1.27; 9 -5.08,-1.27; 10 -5.08,1.27
TSW-115-XX-G-D = drill 1 pad 1.5 octagon: 1 17.78,-1.27; 2 17.78,1.27; 3 15.24,-1.27; 4 15.24,1.27; 5 12.7,-1.27; 6 12.7,1.27; 7 10.16,-1.27; 8 10.16,1.27; 9 7.62,-1.27; 10 7.62,1.27; 11 5.08,-1.27; 12 5.08,1.27; 13 2.54,-1.27; 14 2.54,1.27; 15 0,-1.27; 16 0,1.27; 17 -2.54,-1.27; 18 -2.54,1.27; 19 -5.08,-1.27; 20 -5.08,1.27; 21 -7.62,-1.27; 22 -7.62,1.27; 23 -10.16,-1.27; 24 -10.16,1.27; 25 -12.7,-1.27; 26 -12.7,1.27; 27 -15.24,-1.27; 28 -15.24,1.27; 29 -17.78,-1.27; 30 -17.78,1.27

### Placement (x,y rotation side)
C1  20.12,23.5 0 top
C2  26.77,23.5 0 top
CER1  38.41,15.19 180 top
CER2  4.93,41.28 270 top
CER3  12.44,33.1 90 top
CER4  20.28,33.04 90 top
CER5  20.27,40.75 90 top
CER6  26.92,40.65 90 top
CER7  27.09,32.63 90 top
CER8  43.79,33.95 0 top
CER9  35.54,33.84 0 top
CER10  4.76,33.11 90 top
CER11  27.94,15.52 180 top
CER12  12.52,40.84 270 top
CER13  51.59,11.37 90 top
CER14  50.97,23.57 90 top
CER15  50.97,35.95 90 top
CER16  50.97,48.33 90 top
CER17  64.26,11.4 90 top
CER18  65.02,23.76 90 top
CER19  65.02,36.14 90 top
CER20  64.02,48.52 90 top
D1  39.69,26.53 0 top
D2  15.3,68.33 90 top
J1  13.08,9.6 270 top
LED1  43.31,5.76 180 top
LED2  81,23.74 180 top
LED3  80.93,35.04 180 top
LED4  80.89,45.86 180 top
LED5  81.08,56.95 180 top
R1  14.64,23.26 90 top
R2  45.06,18.61 90 top
R3  53.35,4.44 0 top
R4  57.23,10.86 270 top
R5  53.31,17.06 0 top
R6  57.23,23.18 270 top
R7  52.99,29.06 0 top
R8  57.23,35.5 270 top
R9  57.23,48.66 270 top
R10  53.51,42.06 0 top
R11  69.97,10.61 270 top
R12  65.85,4.59 0 top
R13  70.36,23.69 270 top
R14  66.2,16.81 0 top
R15  66.04,29.81 0 top
R16  70.36,36.17 270 top
R17  64.72,41.81 0 top
R18  70.36,48.49 270 top
R19  33.22,79.14 0 top
R20  33.45,71.14 0 top
R21  33.01,63.14 0 top
R22  33.12,55.2 0 top
R23  33.2,82.96 0 top
R24  33.37,75.26 0 top
R25  33.11,67.14 0 top
R26  33.1,59.26 0 top
R27  33.1,46.14 0 top
R28  81.06,29.76 180 top
R29  80.64,40.96 180 top
R30  81.03,51.65 180 top
R31  81.24,62.85 180 top
R32  32.78,50.78 180 top
S1  89.11,11.29 90 top
SW1  4.2,20.56 90 top
SW2  88.69,21.68 90 top
SW3  88.69,32.52 90 top
SW4  88.69,43.36 90 top
SW5  88.69,54.2 90 top
U1  61.57,70.74 90 top
U2  28.96,7.79 270 top
VT1  21.12,49.5 180 top
VT2  11.28,49.5 180 top
X1  93.95,90.5 90 top
X2  93.16,72.61 90 top
X3  23.07,93.52 180 top
X4  65.92,93.45 180 top

### Tracks (layer width: path | path; a pad name or v marks a point on that pad's centre or on a via)
3V3  (via drill 0.35)
  Top 0.152: U1.80 53.8,74.83 52.58,74.83 50.9,76.5 50.9,79.7 38.41,92.2 X3.28 | 59.89,64.16 59.59,63.86 59.59,63.09 U1.9 | 59.89,64.16 61.27,64.16 61.42,64.01 | 61.42,64.01 61.57,63.86 61.57,63.09 U1.13 | 59.89,64.16 59.89,64.92 57.15,67.67 53.95,67.67 U1.94 | 63.55,76.81 63.25,76.5 62.64,76.5 61.57,77.57 61.57,78.33 U1.63 | 63.55,76.81 63.55,78.33 U1.59 | v70.56,67.21 69.34,67.21 U1.31 69.19,67.36 67.67,67.36 67.36,67.67 v66.9,67.67 | v70.56,74.22 69.34,74.22 U1.45 | 63.55,76.81 67.06,76.81 v67.97,75.89 | X2.8 91.75,70.1 91.75,71.32 81.23,81.84 81.23,92.05 X4.28 | v61.87,64.47 61.42,64.01 | CER3.P$2 12.5,34.75 12.5,39.17 CER12.P$2 12.5,39.32 12.19,39.62 5.03,39.62 CER2.P$2 | U2.2 25.6,7.92 25.6,8.69 24.69,9.6 24.69,22.25 25.91,23.47 C2.P | CER6.P$2 26.82,42.37 20.42,42.37 CER5.P$2 | CER4.P$2 20.42,34.59 26.67,34.59 26.98,34.29 CER7.P$2 | R6.1 57.3,26.98 57.3,21.95 62.33,16.92 R14.1 | CER8.P$2 45.57,33.98 45.57,37.8 49.68,41.91 R10.1 49.84,41.91 51.51,41.91 54.1,39.32 57.15,39.32 R8.1 57.3,39.32 57.91,39.93 70.26,39.93 R16.1 70.41,40.08 71.32,41 71.32,45.11 70.41,46.02 70.41,52.27 R18.1
  Bottom 0.152: X3.28 38.41,92.35 38.41,94.64 X3.27 38.41,94.79 38.86,94.79 41.6,97.54 78.33,97.54 80.16,95.71 80.16,93.12 81.08,92.2 X4.28 81.08,92.05 81.08,88.09 68.89,75.89 | R18.1 70.41,52.43 70.56,52.58 v70.56,67.21 v70.56,74.22 68.89,75.89 | 68.89,75.89 v67.97,75.89 | v61.87,64.47 63.7,64.47 v66.9,67.67 | 14.63,32.46 14.63,27.13 R1.2 | 14.63,32.46 12.5,34.59 CER3.P$2 | CER5.P$2 20.42,42.37 20.42,40.84 21.49,39.78 21.49,35.81 20.42,34.75 CER4.P$2 20.27,34.59 18.14,32.46 14.63,32.46 | C2.P 25.91,23.62 25.91,33.07 26.98,34.14 CER7.P$2 27.13,34.29 33.07,34.29 33.83,35.05 35.97,35.05 37.03,33.98 CER9.P$2 37.19,33.83 40.54,33.83 41.91,32.46 44.04,32.46 45.41,33.83 CER8.P$2 | 60.35,14.78 57.3,14.78 R4.1 | 60.35,14.78 62.33,16.76 R14.1 | 60.35,14.78 62.03,13.11 62.03,4.72 R12.1 | R6.1 57.3,27.13 57.3,28.19 58.22,29.11 58.22,38.25 57.3,39.17 R8.1
+5V
  Top 0.152: R2.2 45.11,22.55 45.11,26.52 D1.A
  Bottom 0.152: J1.1 17.83,8.38 19.2,8.38 26.21,15.39 CER11.P$2 26.36,15.54 33.22,22.4 44.96,22.4 R2.2
DISP_1  (via drill 0.35)
  Top 0.152: v44.04,72.69 44.81,73.46 48.01,73.46 48.77,74.22 53.8,74.22 U1.81
  Bottom 0.152: v44.04,72.69 44.04,70.71 45.41,69.34 45.41,54.56 37.03,46.18 R27.2
DISP_2
  Top 0.152: U1.82 53.95,73.61 58.37,73.61 71.78,60.2 71.78,55.02 67.36,50.6 67.36,45.57 62.03,40.23 56.39,40.23 51.36,45.26 42.22,45.26 36.73,50.75 R32.1
GND  (via drill 0.35)
  Top 0.152: U1.10 60.2,63.09 60.5,63.09 U1.11 60.5,62.94 60.5,55.17 65.23,50.44 65.23,48.31 64.16,47.24 CER20.P$1 | v56.24,68.28 53.95,68.28 U1.93 | v55.93,74.22 55.02,75.13 53.95,75.13 U1.79 | LED1.K 41.91,5.79 41.91,13.11 39.93,15.09 CER1.P$1 39.78,15.24 38.25,15.24 37.19,16.31 29.26,16.31 | CER17.P$1 64.16,10.06 51.66,10.06 CER13.P$1 | J1.S2 13.11,3.66 15.7,6.25 15.7,8.23 J1.4 15.7,8.38 15.7,9.6 13.11,12.19 13.11,15.54 J1.S1 12.95,15.7 8.84,19.81 8.84,20.42 SW1.3 | CER14.P$1 51.05,22.25 51.05,23.62 52.12,24.69 52.12,33.38 51.05,34.44 CER15.P$1 | 10.06,42.22 5.33,42.22 5.03,42.52 CER2.P$1 | 10.06,42.22 12.5,42.22 CER12.P$1 12.65,42.22 15.09,44.65 | 10.06,42.22 10.06,49.38 VT2.E | 15.09,44.65 19.81,49.38 VT1.E | CER10.P$1 4.88,31.85 12.34,31.85 CER3.P$1 12.5,31.7 20.27,31.7 CER4.P$1 20.42,31.55 26.82,31.55 26.98,31.39 CER7.P$1 27.13,31.39 29.57,33.83 | U2.1 25.76,10.21 25.76,11.89 29.26,15.39 CER11.P$1 | C1.N 20.88,23.62 24.54,23.62 25.3,24.38 26.67,24.38 27.43,23.62 C2.N 27.58,23.47 29.26,21.79 29.26,16.31 | 29.57,33.83 34.14,33.83 CER9.P$1 34.29,33.98 35.36,35.05 37.49,35.05 38.56,33.98 42.37,33.98 CER8.P$1 | 29.26,16.31 29.26,15.54 CER11.P$1 | 29.57,33.83 26.98,36.42 26.98,39.17 CER6.P$1 26.82,39.32 20.42,39.32 CER5.P$1 20.27,39.47 15.09,44.65 | 29.26,16.31 CER11.P$1 | CER18.P$1 64.92,22.4 63.86,23.47 63.86,25.76 64.92,26.82 64.92,34.75 CER19.P$1 65.08,34.9 79.55,34.9 LED3.K | 65.53,72.69 67.51,74.68 69.19,74.68 U1.46 69.34,74.83 73.76,74.83 74.07,74.52 v78.33,74.52 | 65.53,72.69 64.47,71.63 64.47,71.02 67.67,67.82 69.19,67.82 U1.32 | 65.53,72.69 v62.03,76.2 60.66,77.57 60.66,78.33 U1.65 60.5,78.49 60.5,79.86 57,83.36 57,94.94 56.24,95.71 47.7,95.71 44.35,92.35 41,92.35 X3.30
  Top 0.152: v62.94,77.11 62.94,78.33 U1.60 | X4.29 83.82,94.64 83.82,92.2 X4.30 83.82,92.05 83.82,85.65 91.75,77.72 X2.2 | S1.1A 92.96,7.62 92.96,9.91 S1.2A 92.96,10.06 92.96,12.5 S1.3A 92.96,12.65 92.96,15.09 S1.4A 92.81,15.24 92.81,17.53 88.7,21.64 SW2.1 88.54,21.79 82.91,21.79 81.08,23.62 | 81.08,23.62 79.86,23.62 LED2.K | 83.67,54.25 81.08,56.84 79.86,56.84 LED5.K | 83.67,54.25 88.54,54.25 SW5.1 88.7,54.25 91.75,57.3 91.75,67.51 X2.10 | 80.92,45.72 79.7,45.72 LED4.K | 83.21,43.43 80.92,45.72 | 83.21,43.43 88.54,43.43 SW4.1 | 83.21,43.43 79.7,39.93 79.7,35.05 LED3.K | 81.99,32.61 88.54,32.61 SW3.1 | 81.99,32.61 79.7,34.9 LED3.K | 83.67,54.25 83.67,50.9 80.92,48.16 80.92,45.72 | 81.08,23.62 81.08,31.7 81.99,32.61
  Bottom 0.152: v55.93,74.22 55.93,73.76 56.24,73.46 v56.24,68.28 56.24,64.92 58.67,62.48 58.67,52.58 64.01,47.24 CER20.P$1 64.01,47.09 63.86,46.94 63.86,37.34 64.92,36.27 64.92,34.9 CER19.P$1 | CER13.P$1 51.51,9.91 46.18,9.91 42.06,5.79 LED1.K | CER18.P$1 65.08,22.25 65.08,13.87 65.38,13.56 65.38,11.12 64.31,10.06 CER17.P$1 | 49.84,35.66 49.84,38.1 50.9,39.17 50.9,46.94 CER16.P$1 | 49.84,35.66 50.9,34.59 CER15.P$1 | C2.N 27.43,23.62 27.43,30.94 27.13,31.24 CER7.P$1 | 49.84,35.66 44.2,35.66 42.52,33.98 CER8.P$1 | J1.S1 13.11,15.7 20.88,23.47 C1.N | X3.30 40.84,92.35 40.84,94.64 X3.29 | v62.03,76.2 v62.94,77.11 | 90.83,75.29 90.83,76.66 91.75,77.57 X2.2 | 90.83,75.29 90.83,69.65 91.75,68.73 91.75,67.67 X2.10 | v78.33,74.52 79.1,75.29 90.83,75.29
  other vias: 37,40 38,40 39,40 39,39 38,39 37,39 4,85 5,85 6,85 6,84 5,84 4,84 90,85 89,85 88,85 90,84 89,84 88,84
  pour Top (isolate 0.61): 7,1 3,1 1,3 1,42 5,46 26,46 31,41 44,41 48,37 48,5 44,1
  pour Top (isolate 0.61): 5,47 26,47 31,42 44,42 49,37 49,3 51,1 96,1 99,4 99,96 96,99 6,99 2,95 2,50
  pour Bottom (isolate 0.61): 4,50 5,50 9,46 25,46 33,38 44,38 48,34 48,4 45,1 7,1 1,7 1,49 2,50
  pour Bottom (isolate 0.61): 5,51 9,47 26,47 36,37 47,37 49,35 49,18 49,3 51,1 96,1 99,4 99,96 96,99 6,99 1,94 1,55
IO/DEV_CLRN  (via drill 0.35)
  Top 0.152: v79.55,74.37 78.79,73.61 69.34,73.61 U1.44 | v79.55,60.5 79.55,58.06 78.18,56.69 78.18,40.54 76.05,38.41 65.99,38.41 65.53,38.86 64.47,38.86 58.22,32.61 56.84,32.61 52.43,28.19 52.43,15.39 45.57,8.53 45.57,5.49 44.81,4.72 41.76,4.72 36.88,9.6 | 36.88,9.6 36.88,15.09 CER1.P$2 | 36.88,9.6 32,4.72 24.84,4.72 24.69,4.88 24.69,6.71 14.78,16.61 14.78,19.36 R1.1
  Bottom 0.152: R1.1 14.63,19.51 5.18,19.51 4.27,20.42 SW1.1 | v79.55,60.5 v79.55,74.37
IO/DEV_OE  (via drill 0.35)
  Top 0.152: v67.82,73.91 68.43,73.3 69.19,73.3 U1.43
  Bottom 0.152: v67.82,73.91 67.82,75.13 67.36,75.59 67.36,85.95 73.46,92.05 X4.22
IO/GCLK0  (via drill 0.35)
  Top 0.152: v61.11,61.57 61.11,62.94 U1.12
  Bottom 0.152: v61.11,61.57 61.11,61.11 68.73,53.49 68.73,51.66 69.65,50.75 74.52,50.75 79.7,55.93 85.34,55.93 95.86,66.45 95.86,92.35 94.03,94.18 X1.1
IO/GCLK1  (via drill 0.35)
  Top 0.152: v62.18,60.96 62.18,62.94 U1.14
  Bottom 0.152: v62.18,60.96 62.18,60.5 69.04,53.65 69.04,51.82 69.8,51.05 72.54,51.05 83.36,61.87 90.22,61.87 95.56,67.21 95.56,90.22 94.03,91.75 X1.2
IO/GCLK2  (via drill 0.35)
  Top 0.152: v62.03,84.28 62.03,78.49 U1.62 | v78.64,96.32 86.87,96.32 93.88,89.31 X1.3
  Bottom 0.152: v62.03,84.28 69.95,92.2 69.95,92.66 71.02,93.73 71.48,93.73 72.54,94.79 72.54,95.25 73.61,96.32 v78.64,96.32
IO/GCLK3  (via drill 0.35)
  Top 0.152: v61.11,85.34 61.11,78.49 U1.64 | v77.88,96.93 87.33,96.93 94.03,90.22 94.49,90.22 94.94,89.76 94.94,87.63 94.03,86.72 X1.4
  Bottom 0.152: v61.11,85.34 61.11,85.95 67.36,92.2 67.36,92.51 68.58,93.73 68.89,93.73 69.95,94.79 69.95,95.1 71.78,96.93 v77.88,96.93
IO_1  (via drill 0.35)
  Top 0.152: v51.66,59.89 51.66,60.2 54.56,63.09 55.47,63.09 U1.1 | v47.7,67.21 47.7,67.46 v46.14,69.01
  Bottom 0.152: v51.66,59.89 47.7,63.86 v47.7,67.21 | v46.14,69.01 46.14,71.51 28.04,89.61 5.94,89.61 3.96,91.59 3.96,93.42 5.18,94.64 X3.1
IO_2  (via drill 0.35)
  Top 0.152: v54.86,62.48 55.32,62.03 55.78,62.03 56.08,62.33 56.08,62.94 U1.2 | v44.5,74.07 v47.7,74.07
  Bottom 0.152: v54.86,62.48 54.86,64.92 52.88,66.9 52.27,66.9 51.97,66.6 51.97,65.99 51.66,65.68 51.05,65.68 47.7,69.04 v47.7,74.07 | v44.5,74.07 44.04,74.07 28.19,89.92 6.1,89.92 4.27,91.75 4.27,92.66 5.33,93.73 6.86,93.73 7.77,94.64 X3.3
IO_3  (via drill 0.35)
  Top 0.152: v50.9,59.13 53.34,59.13 56.54,62.33 56.54,62.94 U1.3 | v44.81,62.03 v47.7,59.13 | v25.15,81.69 18.44,81.69 7.92,92.2 X3.4
  Bottom 0.152: v47.7,59.13 v50.9,59.13 | v25.15,81.69 v44.81,62.03
IO_4  (via drill 0.35)
  Top 0.152: v57.45,66.45 57.15,66.14 57.15,63.09 U1.4 | v50.29,78.49 48.9,79.88 v39.4,79.88 | v15.7,90.53 14.02,92.2 14.02,92.66 12.95,93.73 11.43,93.73 10.52,94.64 X3.5
  Bottom 0.152: v57.45,66.45 57.45,73.61 52.58,78.49 v50.29,78.49 | v39.4,79.88 38.69,79.88 28.04,90.53 v15.7,90.53
IO_5  (via drill 0.35)
  Top 0.152: v50.44,56.84 52.12,56.84 57.45,62.18 57.45,62.94 U1.5 | v48.92,56.54 45.11,56.54 v44.81,56.84 | v20.42,82.3 10.52,92.2 X3.6
  Bottom 0.152: v50.44,56.84 49.23,56.84 v48.92,56.54 | v44.81,56.84 44.81,57.91 v20.42,82.3
IO_6  (via drill 0.35)
  Top 0.152: v58.06,64.92 58.06,63.09 U1.6 | v55.17,71.17 v56.84,69.49 | v40.84,82.3 39.17,82.3 29.26,92.2 29.26,92.66 28.19,93.73 27.74,93.73 26.98,94.49 26.98,96.16 26.67,96.47 14.63,96.47 12.95,94.79 X3.7
  Bottom 0.152: v58.06,64.92 56.84,66.14 v56.84,69.49 | v55.17,71.17 51.97,71.17 v40.84,82.3
IO_7  (via drill 0.35)
  Top 0.152: v51.66,56.24 52.43,56.24 58.52,62.33 58.52,62.94 U1.7 | v48.92,57.45 37.34,57.45 32.77,62.03 32.77,86.11 26.67,92.2 26.67,92.66 25.6,93.73 24.84,93.73 v24.69,93.88
  Bottom 0.152: v51.66,56.24 51.66,56.54 50.75,57.45 v48.92,57.45 | v24.69,93.88 23.62,93.88 23.32,93.57 14.17,93.57 12.95,92.35 X3.8
IO_8  (via drill 0.35)
  Top 0.152: v53.19,53.65 58.98,59.44 58.98,62.94 U1.8 | v53.19,38.86 50.6,38.86 49.99,39.47 49.38,39.47 46.63,36.73 46.63,33.53 45.87,32.77 44.96,32.77 43.59,34.14 43.59,41.6 30.63,54.56 30.63,79.25 18.75,91.14 17.68,91.14 16.46,92.35 16.46,93.73 15.54,94.64 X3.9
  Bottom 0.152: v53.19,38.86 v53.19,53.65
IO_15  (via drill 0.35)
  Top 0.152: v62.48,68.12 62.48,63.09 U1.15
  Bottom 0.152: v62.48,68.12 62.48,73.46 58.52,77.42 58.52,77.57 51.51,84.58 40.39,84.58 33.83,91.14 32.92,91.14 31.7,92.35 31.7,92.66 30.63,93.73 30.18,93.73 29.72,94.18 28.96,94.18 28.04,93.27 16.46,93.27 15.54,92.35 X3.10
IO_16  (via drill 0.35)
  Top 0.152: v63.09,67.36 63.09,63.09 U1.16 | v26.36,95.86 19.2,95.86 18.14,94.79 X3.11
  Bottom 0.152: v63.09,67.36 63.09,73.3 58.83,77.57 58.83,79.25 53.19,84.89 41.6,84.89 34.29,92.2 34.29,92.66 33.22,93.73 32.77,93.73 31.7,94.79 31.7,95.25 31.09,95.86 v26.36,95.86
IO_17  (via drill 0.35)
  Top 0.152: v61.11,58.83 63.55,61.27 63.55,62.94 U1.17 | v51.66,51.21 v59.28,58.83 | v49.38,43.59 42.06,43.59 30.94,54.71 30.94,79.4 18.14,92.2 X3.12
  Bottom 0.152: v59.28,58.83 v61.11,58.83 | v51.66,51.21 50.6,51.21 49.38,49.99 v49.38,43.59
IO_18  (via drill 0.35)
  Top 0.152: v61.72,54.86 64.01,57.15 64.01,62.94 U1.18 | v55.63,48.77 v59.59,52.73 | v53.8,41.91 51.97,41.91 48.92,44.96 41.15,44.96 31.24,54.86 31.24,82.6 21.64,92.2 21.64,93.57 20.57,94.64 X3.13
  Bottom 0.152: v59.59,52.73 v61.72,54.86 | v55.63,48.77 55.63,43.74 v53.8,41.91
IO_19  (via drill 0.35)
  Top 0.152: v55.17,69.04 55.32,68.89 62.64,68.89 64.47,67.06 64.47,63.09 U1.19 | v50.41,70.03 45.8,70.03 v44.81,69.04 | v23.77,89 20.57,92.2 X3.14
  Bottom 0.152: v50.41,70.03 54.17,70.03 v55.17,69.04 | v44.81,69.04 24.84,89 v23.77,89
IO_20
  Top 0.152: U1.20 65.08,62.94 65.08,52.43 67.06,50.44 67.06,45.72 61.87,40.54 56.54,40.54 51.51,45.57 48.77,45.57 32.46,61.87 32.46,83.97 24.08,92.35 24.08,93.73 23.16,94.64 X3.15
IO_21  (via drill 0.35)
  Top 0.152: v65.84,52.58 65.68,52.73 65.68,62.94 U1.21 | v65.84,45.41 61.27,40.84 56.69,40.84 51.66,45.87 50.44,45.87 v40.54,55.78 | v31.85,69.95 31.85,83.52 23.16,92.2 X3.16
  Bottom 0.152: v65.84,45.41 v65.84,52.58 | v40.54,55.78 40.54,61.27 v31.85,69.95
IO_26  (via drill 0.35)
  Top 0.152: v69.34,64.01 69.34,64.62 U1.26 | v71.02,50.14 71.02,51.66 75.59,56.24 75.59,59.74 81.08,65.23 v81.08,81.08
  Bottom 0.152: v69.34,64.01 67.06,64.01 65.23,62.18 60.81,62.18 60.5,61.87 60.5,61.27 68.43,53.34 68.43,51.51 69.8,50.14 v71.02,50.14 | v81.08,81.08 81.08,85.8 82.75,87.48 82.75,91.59 82.45,91.9 82.45,94.94 79.55,97.84 27.43,97.84 25.76,96.16 25.76,94.79 X3.17
IO_27  (via drill 0.35)
  Top 0.152: v71.93,63.25 69.95,65.23 69.34,65.23 U1.27 | v76.2,58.98 76.2,42.98 77.72,41.45 77.72,40.54 75.89,38.71 66.14,38.71 65.68,39.17 64.31,39.17 63.55,38.41 54.56,38.41 53.19,39.78 48.46,39.78 v48.16,39.47
  Bottom 0.152: v76.2,58.98 v71.93,63.25 | v48.16,39.47 48.16,47.24 47.09,48.31 47.09,75.13 31.09,91.14 26.82,91.14 25.76,92.2 X3.18
IO_28  (via drill 0.35)
  Top 0.152: v67.51,66.14 67.82,65.84 69.19,65.84 U1.28 | v56.39,87.02 v56.39,85.8 | v43.89,95.4 43.89,96.16 43.43,96.62 30.02,96.62 28.19,94.79 X3.19
  Bottom 0.152: v67.51,66.14 67.51,71.78 66.29,73 66.29,75.89 v56.39,85.8 | v56.39,87.02 51.82,87.02 43.89,94.94 v43.89,95.4
IO_29  (via drill 0.35)
  Top 0.152: v71.17,66.29 69.34,66.29 U1.29 | v74.37,75.13 74.37,91.59 74.52,91.75 74.52,95.25 73.76,96.01 v46.33,96.01 | v43.13,96.01 41.6,96.01 41.45,96.16 30.63,96.16 29.41,94.94 v29.41,93.57
  Bottom 0.152: v71.17,66.29 71.17,71.93 v74.37,75.13 | v43.13,96.01 v46.33,96.01 | v29.41,93.57 28.19,92.35 X3.20
IO_30  (via drill 0.35)
  Top 0.152: v60.5,73.15 66.9,66.75 69.19,66.75 U1.30 | v39.22,84.77 31.7,92.29 31.7,93.73 30.79,94.64 X3.21
  Bottom 0.152: v60.5,73.15 60.5,74.98 58.22,77.27 58.22,77.42 51.36,84.28 39.78,84.28 39.32,84.73 v39.22,84.77
IO_33  (via drill 0.35)
  Top 0.152: v49.84,82.91 49.84,82.45 56.69,75.59 56.84,75.59 69.8,62.64 72.24,62.64 72.54,62.94 72.54,66.14 70.56,68.12 69.34,68.12 U1.33
  Bottom 0.152: v49.84,82.91 40.08,82.91 30.79,92.2 X3.22
IO_34  (via drill 0.35)
  Top 0.152: v65.08,71.32 67.67,68.73 69.19,68.73 U1.34 | v42.67,94.18 42.67,94.49 41.3,95.86 34.44,95.86 33.38,94.79 X3.23
  Bottom 0.152: v65.08,71.32 65.08,71.78 59.13,77.72 59.13,79.4 53.34,85.19 51.36,85.19 42.67,93.88 v42.67,94.18
IO_35  (via drill 0.35)
  Top 0.152: v65.99,71.32 67.97,69.34 69.19,69.34 U1.35 | v41.76,93.88 41.45,93.88 41.15,93.57 34.59,93.57 33.38,92.35 X3.24
  Bottom 0.152: v65.99,71.32 59.44,77.88 59.44,79.55 53.49,85.5 51.51,85.5 43.28,93.73 43.28,94.49 42.98,94.79 42.37,94.79 41.76,94.18 v41.76,93.88
IO_36  (via drill 0.35)
  Top 0.152: v65.99,72.24 68.43,69.8 69.19,69.8 U1.36
  Bottom 0.152: v65.99,72.24 65.99,74.98 55.17,85.8 51.66,85.8 43.59,93.88 43.59,94.64 42.37,95.86 40.39,95.86 39.32,94.79 39.32,91.75 38.71,91.14 37.95,91.14 36.88,92.2 36.88,93.57 35.81,94.64 X3.25
IO_37
  Top 0.152: U1.37 69.34,70.26 76.66,70.26 76.81,70.1 77.42,70.1 80.47,73.15 80.47,91.44 79.7,92.2 79.7,92.51 78.49,93.73 78.18,93.73 77.11,94.79 77.11,95.1 75.59,96.62 46.02,96.62 42.67,93.27 36.73,93.27 35.81,92.35 X3.26
IO_38  (via drill 0.35)
  Top 0.152: v77.11,70.71 69.34,70.71 U1.38
  Bottom 0.152: v77.11,70.71 77.11,83.67 82.14,88.7 82.14,93.73 81.23,94.64 X4.27
IO_39
  Top 0.152: U1.39 69.34,71.32 77.42,71.32 80.16,74.07 80.16,90.53 78.64,92.05 X4.26
IO_40  (via drill 0.35)
  Top 0.152: v77.72,73 76.5,71.78 69.34,71.78 U1.40 | v82.14,87.78 82.14,92.66 81.08,93.73 79.55,93.73 78.64,94.64 X4.25
  Bottom 0.152: v77.72,73 77.72,83.36 v82.14,87.78
IO_41  (via drill 0.35)
  Top 0.152: v67.67,73 68.43,72.24 69.19,72.24 U1.41
  Bottom 0.152: v67.67,73 67.06,73.61 67.06,86.26 72.54,91.75 72.54,92.66 73.15,93.27 74.98,93.27 76.05,92.2 X4.24
IO_42  (via drill 0.35)
  Top 0.152: v71.17,72.85 69.34,72.85 U1.42 | v74.98,76.66 74.98,93.57 76.05,94.64 X4.23
  Bottom 0.152: v74.98,76.66 v71.17,72.85
IO_47
  Top 0.152: U1.47 69.34,75.29 70.56,75.29 72.54,77.27 72.54,93.73 73.46,94.64 X4.21
IO_48
  Top 0.152: U1.48 69.34,75.74 70.56,75.74 71.78,76.96 71.78,91.29 71.02,92.05 X4.20
IO_49
  Top 0.152: U1.49 69.19,76.35 68.43,76.35 67.97,76.81 67.97,84.43 67.36,85.04 67.36,92.51 68.58,93.73 69.95,93.73 70.87,94.64 X4.19
IO_50
  Top 0.152: U1.50 69.19,76.81 69.19,83.67 67.67,85.19 67.67,91.29 68.43,92.05 X4.18
IO_51
  Top 0.152: U1.51 67.51,78.49 67.51,84.43 67.06,84.89 67.06,93.27 68.43,94.64 X4.17
IO_52
  Top 0.152: U1.52 67.06,78.49 67.06,84.43 65.99,85.5 65.99,92.05 X4.16
IO_53
  Top 0.152: U1.53 66.6,78.49 66.6,84.43 64.92,86.11 64.92,93.73 65.84,94.64 X4.15
IO_54
  Top 0.152: U1.54 66.14,78.49 66.14,84.43 63.4,87.17 63.4,92.05 X4.14
IO_55
  Top 0.152: U1.55 65.68,78.49 65.68,84.43 62.33,87.78 62.33,93.73 63.25,94.64 X4.13
IO_56  (via drill 0.35)
  Top 0.152: v65.08,83.67 65.08,78.49 U1.56 | v63.7,85.04 63.7,85.5 60.96,88.24 60.96,92.05 X4.12
  Bottom 0.152: v63.7,85.04 v65.08,83.67
IO_57
  Top 0.152: U1.57 64.47,78.49 64.47,85.19 61.87,87.78 61.87,93.73 60.96,94.64 X4.11
IO_58
  Top 0.152: U1.58 64.01,78.49 64.01,83.82 58.37,89.46 58.37,92.05 X4.10
IO_61
  Top 0.152: U1.61 62.64,78.49 62.64,84.73 57.3,90.07 57.3,93.73 58.22,94.64 X4.9
IO_66
  Top 0.152: U1.66 60.05,78.49 60.05,79.86 55.78,84.12 55.78,92.05 X4.8
IO_67
  Top 0.152: U1.67 59.59,78.49 59.59,79.86 54.71,84.73 54.71,93.73 55.63,94.64 X4.7
IO_68
  Top 0.152: U1.68 58.98,78.49 58.98,80.01 53.34,85.65 53.34,92.05 X4.6
IO_69
  Top 0.152: U1.69 58.52,78.49 58.52,80.01 52.88,85.65 52.88,90.98 52.12,91.75 52.12,93.57 53.19,94.64 X4.5
IO_74
  Top 0.152: U1.74 56.08,78.49 56.08,81.99 52.58,85.5 52.58,90.22 50.75,92.05 X4.4
IO_75
  Top 0.152: U1.75 55.47,78.49 55.47,80.77 49.68,86.56 49.68,93.73 50.6,94.64 X4.3
IO_76
  Top 0.152: U1.76 53.8,76.81 53.8,77.57 48.16,83.21 48.16,92.05 X4.2
IO_77
  Top 0.152: U1.77 53.95,76.35 54.71,76.35 54.86,76.5 54.86,76.96 49.23,82.6 49.23,93.57 48.16,94.64 X4.1
IO_78  (via drill 0.35)
  Top 0.152: v52.58,75.74 53.8,75.74 U1.78 | v45.57,75.74 v48.31,75.74
  Bottom 0.152: v48.31,75.74 v52.58,75.74 | v45.57,75.74 30.48,90.83 16.31,90.83 16,91.14 6.4,91.14 5.33,92.2 X3.2
LED1  (via drill 0.35)
  Top 0.152: v59.59,73.76 59.59,76.05 58.06,77.57 58.06,78.33 U1.70
  Bottom 0.152: v59.59,73.76 59.59,72.39 60.2,71.78 60.2,61.11 65.23,56.08 65.23,39.17 69.34,35.05 69.34,32 71.48,29.87 77.11,29.87 R28.2
LED2  (via drill 0.35)
  Top 0.152: v57.61,77.11 57.61,78.33 U1.71 | v63.25,39.32 64.01,39.32 64.16,39.47 69.49,39.47 69.95,39.01 74.98,39.01 76.81,40.84 R29.2
  Bottom 0.152: v57.61,77.11 54.41,77.11 52.43,79.1 49.99,79.1 49.68,78.79 49.68,78.18 51.51,76.35 52.88,76.35 55.78,73.46 55.78,68.73 55.63,68.58 55.63,65.08 58.37,62.33 58.37,50.29 63.25,45.41 v63.25,39.32
LED3  (via drill 0.35)
  Top 0.152: v57,76.2 57,78.33 U1.72 | v66.45,50.14 v64.62,51.97
  Bottom 0.152: v57,76.2 57,74.52 59.89,71.63 59.89,60.96 64.62,56.24 v64.62,51.97 | v66.45,50.14 66.45,47.24 69.95,43.74 70.71,43.74 77.11,50.14 77.11,51.51 R30.2
LED4  (via drill 0.35)
  Top 0.152: v56.69,80.47 56.69,78.49 U1.73 | v52.88,84.28 52.88,84.73 51.97,85.65 v51.97,86.41 | v68.28,88.85 68.28,85.04 71.17,82.14 v71.17,77.27 | v75.59,69.19 75.59,64.77 77.42,62.94 R31.2
  Bottom 0.152: v52.88,84.28 v56.69,80.47 | v51.97,86.41 58.98,86.41 62.33,83.06 65.38,83.06 66.45,84.12 66.45,87.02 v68.28,88.85 | v71.17,77.27 75.29,77.27 75.59,76.96 v75.59,69.19
N$13
  Top 0.152: LED1.A 44.65,5.79 44.65,14.48 44.96,14.78 R2.1
N$14
  Top 0.152: U2.3 25.6,5.64 25.6,6.4 19.51,12.5 19.51,23.47 C1.P 19.51,23.62 22.4,26.52 34.29,26.52 D1.C
  Bottom 0.152: CER10.P$2 4.88,34.59 5.79,34.59 16.76,23.62 19.36,23.62 C1.P
N$29
  Top 0.152: R12.2 69.8,4.72 69.8,6.55 69.95,6.71 R11.2
  Bottom 0.152: SW2.3 93.12,21.64 93.12,21.34 85.5,13.72 76.96,13.72 70.1,6.86 R11.2
N$30
  Top 0.152: R3.2 57.15,4.57 57.15,7.01 R4.2 57.3,7.16 57.91,7.77 70.26,7.77 70.41,7.62 85.19,7.62 S1.1B
N$31
  Top 0.152: R6.2 57.15,19.36 57.15,17.07 R5.2 57.15,16.92 58.22,15.85 69.8,15.85 75.59,10.06 85.19,10.06 S1.2B
N$32
  Top 0.152: R9.2 57.3,44.81 57.3,42.06 R10.2
  Bottom 0.152: S1.4B 85.19,15.24 73.61,15.24 66.14,22.71 66.14,31.24 59.13,38.25 59.13,40.23 57.45,41.91 R10.2
N$33
  Top 0.152: R8.2 57.15,31.55 56.84,31.24 56.84,29.11 R7.2 56.84,28.96 64.62,21.18 70.41,21.18 78.94,12.65 85.19,12.65 S1.3B
N$34
  Top 0.152: R14.2 70.1,16.92 70.1,19.66 70.26,19.81 R13.2
  Bottom 0.152: SW3.3 93.12,32.46 90.53,32.46 82.75,24.69 75.13,24.69 70.41,19.96 R13.2
N$35
  Top 0.152: R15.2 69.95,29.87 69.95,32 70.26,32.31 R16.2
  Bottom 0.152: SW4.3 93.12,43.28 90.53,43.28 83.21,35.97 73.91,35.97 70.41,32.46 R16.2
N$36
  Top 0.152: R17.2 68.58,41.91 68.58,42.98 70.26,44.65 R18.2
  Bottom 0.152: SW5.3 93.12,54.1 90.53,54.1 89,52.58 76.81,52.58 70.41,46.18 70.41,44.81 R18.2
N$37
  Bottom 0.152: 8.53,75.13 8.53,73 6.71,71.17 6.71,65.53 7.62,64.62 7.62,63.4 D2.16 | 8.53,75.13 7.77,75.89 D2.11 | 8.53,75.13 16.31,82.91 29.26,82.91 R23.1
N$38
  Top 0.152: D2.15 7.62,65.84 7.62,67.21 6.71,68.12 6.71,77.57 7.62,78.49 D2.10 7.77,78.64 8.53,79.4 23.32,79.4 23.47,79.25 29.26,79.25 R19.1
N$39
  Top 0.152: D2.3 22.86,63.4 22.86,64.62 21.95,65.53 21.95,74.98 22.86,75.89 D2.8 23.01,75.89 23.62,75.29 29.41,75.29 R24.1
N$40
  Bottom 0.152: 23.77,70.1 23.77,62.79 23.01,62.03 23.01,60.81 D2.2 | 23.77,70.1 23.01,70.87 D2.6 | 23.77,70.1 24.69,71.02 29.57,71.02 R20.1
N$41
  Bottom 0.152: D2.9 22.86,78.49 21.95,77.57 21.95,68.12 22.86,67.21 22.86,65.84 D2.4 22.86,65.68 21.95,64.77 21.95,60.5 22.71,59.74 23.01,59.74 27.43,55.32 29.26,55.32 R22.1
N$42
  Top 0.152: D2.17 7.77,60.66 7.77,59.28 11.43,55.63 11.43,49.07 12.19,48.31 16,48.31 26.82,59.13 29.26,59.13 R26.1 29.41,59.28 30.33,60.2 30.33,67.51 24.54,73.3 23.01,73.3 D2.7
N$43
  Top 0.152: R21.1 29.11,63.09 29.11,62.79 23.62,57.3 22.25,57.3 8.53,71.02 8.53,72.54 7.77,73.3 D2.12
  Bottom 0.152: D2.18 7.62,58.22 7.62,59.59 6.4,60.81 6.4,72.08 7.62,73.3 D2.12
N$44
  Top 0.152: 23.77,67.21 23.77,67.51 23.01,68.28 D2.5 | 23.77,67.21 23.77,60.35 23.01,59.59 23.01,58.22 D2.1 | 23.77,67.21 29.26,67.21 R25.1
N$45
  Top 0.152: D2.13 7.77,70.87 7.77,69.49 12.5,64.77 12.5,49.53 VT2.C
N$46
  Bottom 0.152: D2.14 7.77,68.28 7.77,66.9 22.25,52.43 22.25,49.53 VT1.C
N$47
  Top 0.152: R27.1 29.26,46.18 22.55,46.18 21.18,47.55 VT1.B
N$48
  Top 0.152: R32.2 28.96,50.75 18.9,50.75 15.85,47.7 11.43,47.7 VT2.B
N$49
  Top 0.152: LED2.A 82.3,23.77 82.3,27.28 84.73,29.72 R28.1
N$50
  Top 0.152: LED3.A 82.3,35.05 82.3,38.71 84.43,40.84 R29.1
N$51
  Top 0.152: LED4.A 82.3,45.87 82.3,49.07 84.73,51.51 R30.1
N$52
  Top 0.152: LED5.A 82.45,57 82.45,60.2 85.04,62.79 R31.1
PB_1  (via drill 0.35)
  Top 0.152: v52.58,66.29 53.8,66.29 U1.97 | R11.1 69.95,14.33 65.53,14.33 64.31,13.11 CER17.P$2
  Bottom 0.152: v52.58,66.29 52.58,64.01 52.27,63.7 52.27,60.66 52.58,60.35 52.58,27.89 64.16,16.31 64.16,13.11 CER17.P$2
PB_2  (via drill 0.35)
  Top 0.152: v51.36,66.29 51.97,65.68 53.8,65.68 U1.98 | CER18.P$2 65.08,25.45 68.28,25.45 70.26,27.43 R13.1
  Bottom 0.152: v51.36,66.29 51.66,66.6 51.66,66.75 52.12,67.21 53.03,67.21 56.24,64.01 56.24,51.97 62.64,45.57 62.64,35.2 70.26,27.58 R13.1
PB_3  (via drill 0.35)
  Top 0.152: v52.88,63.4 52.88,64.92 53.19,65.23 53.8,65.23 U1.99 | CER19.P$2 64.92,37.64 64.92,36.27 62.33,33.68 62.33,29.87 R15.1
  Bottom 0.152: v52.88,63.4 52.88,54.86 56.24,51.51 56.24,41.6 58.83,39.01 58.83,33.22 62.18,29.87 R15.1
PB_4
  Top 0.152: 58.67,44.81 60.81,42.67 60.81,41.91 R17.1 | 58.67,44.81 55.32,48.16 51.21,48.16 49.53,49.84 49.53,59.13 53.8,63.4 53.8,64.62 U1.100 | 58.67,44.81 64.01,50.14 CER20.P$2
SEG_A
  Top 0.152: U1.83 53.8,73.15 45.41,73.15 44.35,72.08 43.74,72.08 37.95,77.88 37.95,81.99 37.03,82.91 R23.2
SEG_B
  Top 0.152: U1.84 53.8,72.69 45.41,72.69 44.5,71.78 43.59,71.78 37.03,78.33 37.03,79.1 R19.2
SEG_C
  Top 0.152: U1.85 53.8,72.24 45.41,72.24 44.65,71.48 40.84,71.48 37.19,75.13 R24.2
SEG_D
  Top 0.152: U1.86 53.8,71.63 45.26,71.63 44.81,71.17 37.34,71.17 R20.2
SEG_DP  (via drill 0.35)
  Top 0.152: v39.93,58.06 51.51,69.65 53.8,69.65 U1.90
  Bottom 0.152: v39.93,58.06 37.03,55.17 R22.2
SEG_E
  Top 0.152: U1.87 53.8,71.17 45.26,71.17 41.3,67.21 37.03,67.21 R25.2
SEG_F
  Top 0.152: U1.88 53.8,70.71 45.26,70.71 37.8,63.25 36.88,63.25 R21.2
SEG_G
  Top 0.152: U1.89 53.8,70.26 51.66,70.26 40.69,59.28 37.03,59.28 R26.2
SW_1  (via drill 0.35)
  Top 0.152: v46.02,62.79 52.43,69.19 53.8,69.19 U1.91 | R3.1 49.68,4.57 49.68,11.12 51.51,12.95 CER13.P$2
  Bottom 0.152: v46.02,62.79 46.02,39.17 41.3,34.44 41.3,33.53 42.06,32.77 42.82,32.77 44.35,34.29 44.35,34.44 44.96,35.05 45.87,35.05 48.16,32.77 48.16,16.46 51.51,13.11 CER13.P$2
SW_2  (via drill 0.35)
  Top 0.152: v50.14,62.33 50.14,66.45 52.43,68.73 53.8,68.73 U1.92 | R5.1 49.53,17.07 49.53,23.77 50.9,25.15 CER14.P$2
  Bottom 0.152: v50.14,62.33 52.27,60.2 52.27,26.52 51.05,25.3 CER14.P$2
SW_3  (via drill 0.35)
  Top 0.152: v48.31,58.37 50.75,60.81 50.75,66.6 51.36,67.21 53.8,67.21 U1.95 | v49.68,38.86 50.9,37.64 CER15.P$2 50.9,37.49 49.23,35.81 49.23,29.11 R7.1
  Bottom 0.152: v48.31,58.37 48.31,47.55 48.77,47.09 48.77,39.78 v49.68,38.86
SW_4
  Top 0.152: U1.96 53.95,66.75 54.71,66.75 54.86,66.6 54.86,64.01 49.84,58.98 49.84,51.05 50.9,49.99 CER16.P$2 51.05,49.99 51.36,49.99 53.8,52.43 57.15,52.43 R9.1
TCK_IC1  (via drill 0.35)
  Top 0.152: v71.17,59.89 69.49,59.89 67.06,62.33 67.06,62.94 U1.24
  Bottom 0.152: v71.17,59.89 71.17,63.86 78.94,71.63 78.94,74.68 79.25,74.98 82.91,74.98 91.44,66.45 93.27,66.45 94.34,67.51 X2.9
TDI_IC1  (via drill 0.35)
  Top 0.152: v66.6,64.47 66.6,63.09 U1.23 | v77.57,95.56 78.03,95.56 78.18,95.71 84.12,95.71 92.96,86.87 92.96,79.1 94.34,77.72 X2.1
  Bottom 0.152: v66.6,64.47 67.67,65.53 67.82,65.53 68.12,65.84 68.12,71.63 66.75,73 66.75,86.41 72.24,91.9 72.24,92.81 73.15,93.73 76.5,93.73 77.57,94.79 v77.57,95.56
TDO_IC1  (via drill 0.35)
  Top 0.152: v69.34,61.27 67.67,62.94 U1.25 | v87.33,66.45 88.39,66.45 90.98,69.04 93.42,69.04 94.34,69.95 X2.7
  Bottom 0.152: v69.34,61.27 69.34,51.97 69.95,51.36 72.24,51.36 v87.33,66.45
TMS_IC1  (via drill 0.35)
  Top 0.152: v71.17,58.98 69.34,58.98 66.14,62.18 66.14,62.94 U1.22 | v89.92,67.06 91.59,68.73 94.49,68.73 95.56,69.8 95.56,71.48 94.49,72.54 X2.5
  Bottom 0.152: v71.17,58.98 75.29,58.98 75.89,58.37 78.33,58.37 87.02,67.06 v89.92,67.06
(copper drawn outside any net)
  shapes: Top area x2

### Text on the board
tNames: IO_30 | IO_1 | IO_2 | IO_4 | IO_6 | IO_8 | IO_16 | IO_18 | IO_20 | IO_26 | IO_28 | IO_34 | IO_36 | 3V3 | GND | IO_77 | IO_75 | IO_69 | IO_67 | IO_61 | IO_57 | IO_55 | IO_53 | IO_51 | IO_49 | IO_47 | IO_42 | IO_40 | IO_38 | GND | IO/GCLK0 | IO/GCLK1 | IO/GCLK2 | 3V3 | 3V3 | IO_78 | IO_3 | IO_5 | IO_7 | IO_15 | IO_17 | IO_19 | IO_21 | IO_27 | IO_29 | IO_33 | IO_35 | IO_37 | GND | IO_74 | GND | IO_76 | IO_68 | IO_66 | IO_58 | IO_56 | IO_54 | IO_52 | IO_50 | IO_48 | IO_41 | IO_39 | IO/GCLK3 | IO/DEV_OE | GND | TDI | TMS | 3V3 | TDO | GND | TCK